# EAGLE design narvi-dac (EAGLE 7.3.0)
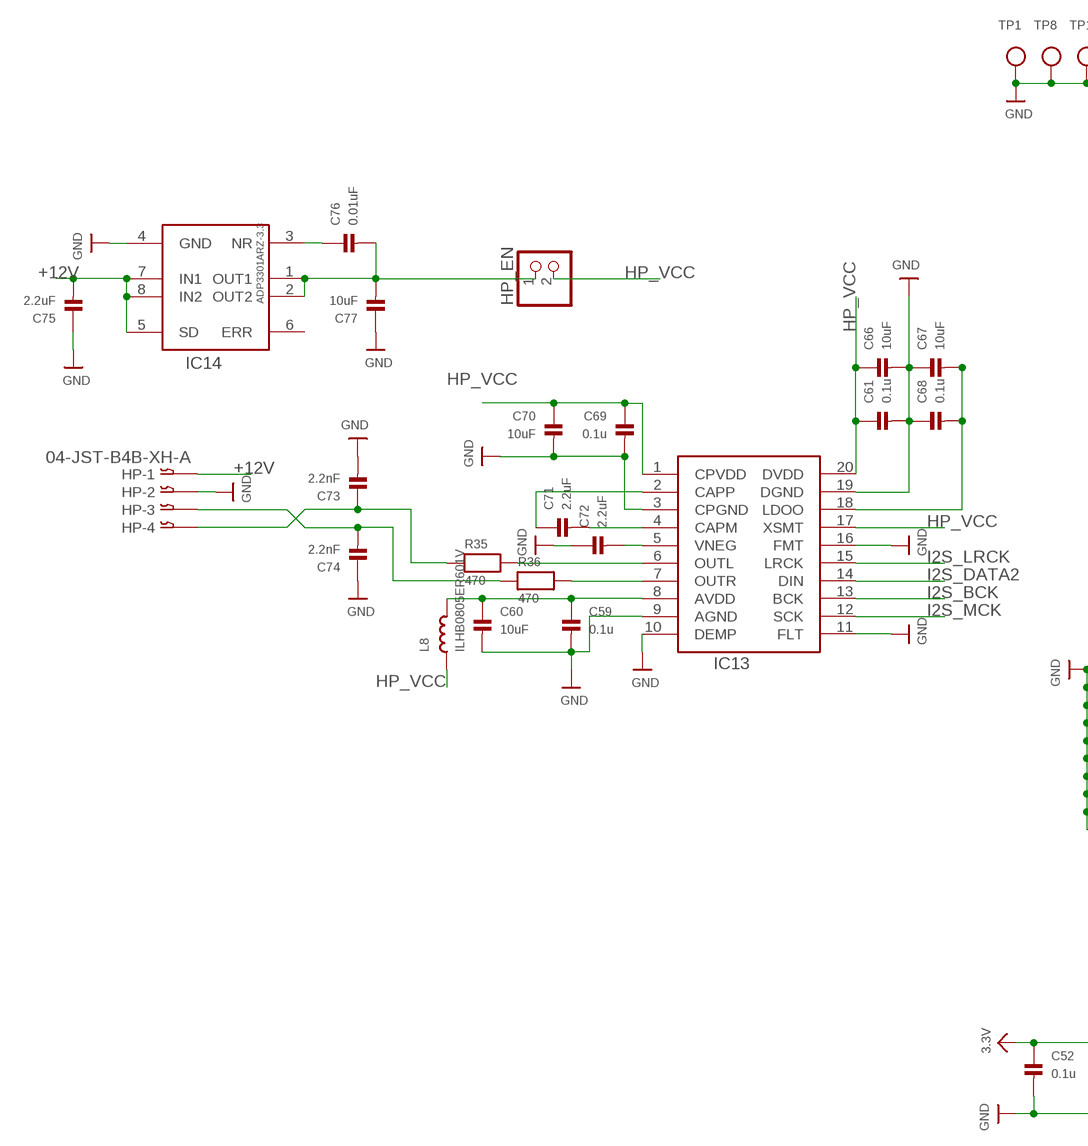
[diagram p0: schematic, sheet 1, part 1 of 2]
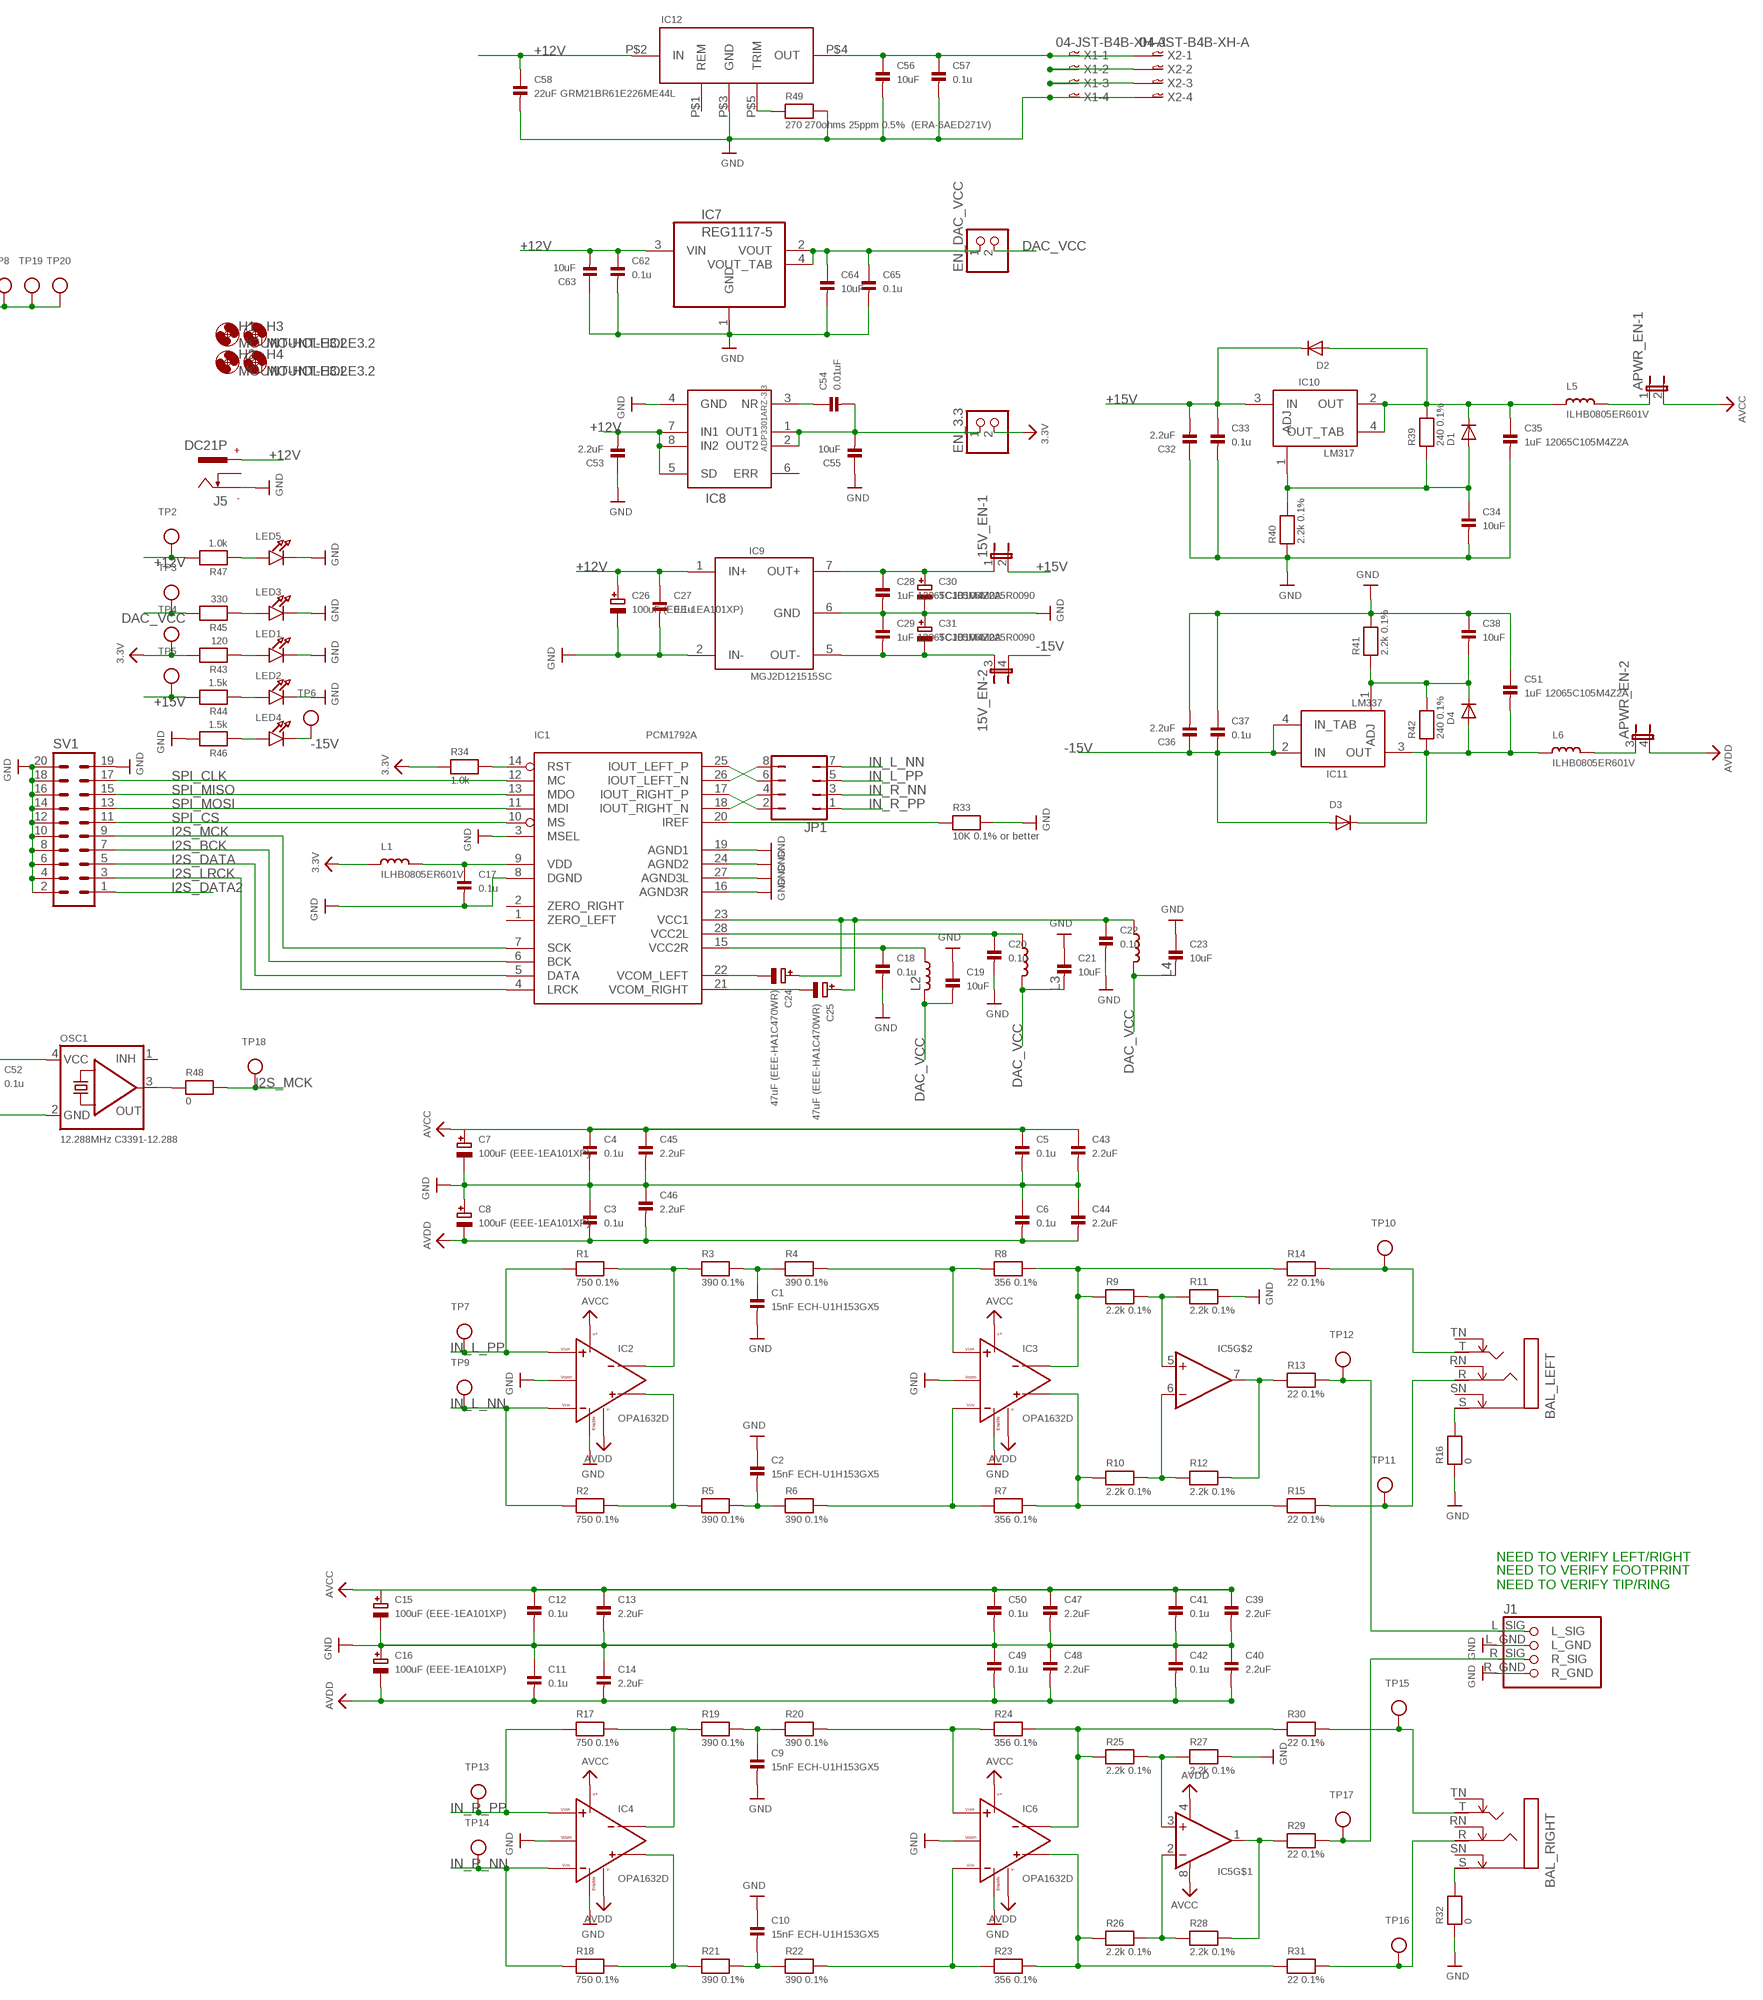
[diagram p1: schematic, sheet 1, part 2 of 2]

## Parts
15V_EN  JP2QE  [JP2Q]
APWR_EN  JP2QE  [JP2Q]
BAL_LEFT  STEREOSW  [NMJ6HCD2]
BAL_RIGHT  STEREOSW  [NMJ6HCD2]
C1  15nF ECH-U1H153GX5  CAP-1210  [1210]
C2  15nF ECH-U1H153GX5  CAP-1210  [1210]
C3  0.1u  CAP_CERAMIC0603  [0603]
C4  0.1u  CAP_CERAMIC0603  [0603]
C5  0.1u  CAP_CERAMIC0603  [0603]
C6  0.1u  CAP_CERAMIC0603  [0603]
C7  100uF (EEE-1EA101XP)  CAP_ELECTROLYTICPANASONIC_D  [PANASONIC_D]
C8  100uF (EEE-1EA101XP)  CAP_ELECTROLYTICPANASONIC_D  [PANASONIC_D]
C9  15nF ECH-U1H153GX5  CAP-1210  [1210]
C10  15nF ECH-U1H153GX5  CAP-1210  [1210]
C11  0.1u  CAP_CERAMIC0603  [0603]
C12  0.1u  CAP_CERAMIC0603  [0603]
C13  2.2uF  CAP_CERAMIC_0805  [_0805]
C14  2.2uF  CAP_CERAMIC_0805  [_0805]
C15  100uF (EEE-1EA101XP)  CAP_ELECTROLYTICPANASONIC_D  [PANASONIC_D]
C16  100uF (EEE-1EA101XP)  CAP_ELECTROLYTICPANASONIC_D  [PANASONIC_D]
C17  0.1u  CAP_CERAMIC0603  [0603]
C18  0.1u  CAP_CERAMIC0603  [0603]
C19  10uF  CAP_CERAMIC0805  [0805]
C20  0.1u  CAP_CERAMIC0603  [0603]
C21  10uF  CAP_CERAMIC0805  [0805]
C22  0.1u  CAP_CERAMIC0603  [0603]
C23  10uF  CAP_CERAMIC0805  [0805]
C24  47uF (EEE-HA1C470WR)  CAP_ELECTROLYTICPANASONIC_C  [PANASONIC_C]
C25  47uF (EEE-HA1C470WR)  CAP_ELECTROLYTICPANASONIC_C  [PANASONIC_C]
C26  100uF (EEE-1EA101XP)  CAP_ELECTROLYTICPANASONIC_D  [PANASONIC_D]
C27  0.1u  CAP_CERAMIC0603  [0603]
C28  1uF 12065C105M4Z2A  CAP_CERAMIC1206  [1206]
C29  1uF 12065C105M4Z2A  CAP_CERAMIC1206  [1206]
C30  TCJB106M025R0090  CAP-POL-1210  [1210POL]
C31  TCJB106M025R0090  CAP-POL-1210  [1210POL]
C32  2.2uF  CAP_CERAMIC_0805  [_0805]
C33  0.1u  CAP_CERAMIC0603  [0603]
C34  10uF  CAP_CERAMIC0805  [0805]
C35  1uF 12065C105M4Z2A  CAP_CERAMIC1206  [1206]
C36  2.2uF  CAP_CERAMIC_0805  [_0805]
C37  0.1u  CAP_CERAMIC0603  [0603]
C38  10uF  CAP_CERAMIC0805  [0805]
C39  2.2uF  CAP_CERAMIC_0805  [_0805]
C40  2.2uF  CAP_CERAMIC_0805  [_0805]
C41  0.1u  CAP_CERAMIC0603  [0603]
C42  0.1u  CAP_CERAMIC0603  [0603]
C43  2.2uF  CAP_CERAMIC_0805  [_0805]
C44  2.2uF  CAP_CERAMIC_0805  [_0805]
C45  2.2uF  CAP_CERAMIC_0805  [_0805]
C46  2.2uF  CAP_CERAMIC_0805  [_0805]
C47  2.2uF  CAP_CERAMIC_0805  [_0805]
C48  2.2uF  CAP_CERAMIC_0805  [_0805]
C49  0.1u  CAP_CERAMIC0603  [0603]
C50  0.1u  CAP_CERAMIC0603  [0603]
C51  1uF 12065C105M4Z2A  CAP_CERAMIC1206  [1206]
C52  0.1u  CAP_CERAMIC0603  [0603]
C53  2.2uF  CAP_CERAMIC_0805  [_0805]
C54  0.01uF  CAP_CERAMIC0603  [0603]
C55  10uF  CAP_CERAMIC0805  [0805]
C56  10uF  CAP_CERAMIC0805  [0805]
C57  0.1u  CAP_CERAMIC0603  [0603]
C58  22uF GRM21BR61E226ME44L  CAP_CERAMIC_0805  [_0805]
C59  0.1u  CAP_CERAMIC0603  [0603]
C60  10uF  CAP_CERAMIC0805  [0805]
C61  0.1u  CAP_CERAMIC0603  [0603]
C62  0.1u  CAP_CERAMIC0603  [0603]
C63  10uF  CAP_CERAMIC0805  [0805]
C64  10uF  CAP_CERAMIC0805  [0805]
C65  0.1u  CAP_CERAMIC0603  [0603]
C66  10uF  CAP_CERAMIC0805  [0805]
C67  10uF  CAP_CERAMIC0805  [0805]
C68  0.1u  CAP_CERAMIC0603  [0603]
C69  0.1u  CAP_CERAMIC0603  [0603]
C70  10uF  CAP_CERAMIC0805  [0805]
C71  2.2uF  CAP_CERAMIC_0805  [_0805]
C72  2.2uF  CAP_CERAMIC_0805  [_0805]
C73  2.2nF  CAP_CERAMIC_0805  [_0805]
C74  2.2nF  CAP_CERAMIC_0805  [_0805]
C75  2.2uF  CAP_CERAMIC_0805  [_0805]
C76  0.01uF  CAP_CERAMIC0603  [0603]
C77  10uF  CAP_CERAMIC0805  [0805]
D1  DIODESOD-123  [SOD-123]
D2  DIODESOD-123  [SOD-123]
D3  DIODESOD-123  [SOD-123]
D4  DIODESOD-123  [SOD-123]
EN_3.3  HEADER-1X2  [1X02_OVAL]
EN_DAC_VCC  HEADER-1X2  [1X02_OVAL]
H1  MOUNT-HOLE3.2  [3,2]
H2  MOUNT-HOLE3.2  [3,2]
H3  MOUNT-HOLE3.2  [3,2]
H4  MOUNT-HOLE3.2  [3,2]
HP  04-JST-B4B-XH-A  [B4B-XH]
HP_EN  HEADER-1X2  [1X02_OVAL]
IC1  PCM1792A  [SSOP28]
IC2  OPA1632D  [SO08]
IC3  OPA1632D  [SO08]
IC4  OPA1632D  [SO08]
IC5  LM4562  [SOIC8_150MIL]
IC6  OPA1632D  [SO08]
IC7  REG1117-5  REG1117  [SOT223]
IC8  ADP3301ARZ-3.3  ADP3301  [SO08]
IC9  MGJ2D121515SC  MURATA-MGJ2  [MURATA-MGJ2]
IC10  LM317  [SOT223]
IC11  LM337  [SOT223]
IC12  MURATA_OKR-T/10-W12-C  [MURATA_OKR-T/10-W12-C]
IC13  PCM5102  [TSSOP20]
IC14  ADP3301ARZ-3.3  ADP3301  [SO08]
J1  CUI-RCJ-2123  [CUI-RCJ-2123]
J5  DC21P  [CUI-PJ-102AH]
JP1  JP4Q  [JP4Q]
L1  ILHB0805ER601V  INDUCTOR_0805  [_0805]
L2  ILHB0805ER601V  INDUCTOR_0805  [_0805]
L3  ILHB0805ER601V  INDUCTOR_0805  [_0805]
L4  ILHB0805ER601V  INDUCTOR_0805  [_0805]
L5  ILHB0805ER601V  INDUCTOR_0805  [_0805]
L6  ILHB0805ER601V  INDUCTOR_0805  [_0805]
L8  ILHB0805ER601V  INDUCTOR_0805  [_0805]
LED1  LED0805  [CHIPLED_0805]
LED2  LED0805  [CHIPLED_0805]
LED3  LED0805  [CHIPLED_0805]
LED4  LED0805  [CHIPLED_0805]
LED5  LED0805  [CHIPLED_0805]
OSC1  12.288MHz C3391-12.288  OSCILLATOR  [OSC_7X5MM]
R1  750 0.1%  RESISTOR_0805  [_0805]
R2  750 0.1%  RESISTOR_0805  [_0805]
R3  390 0.1%  RESISTOR_0805  [_0805]
R4  390 0.1%  RESISTOR_0805  [_0805]
R5  390 0.1%  RESISTOR_0805  [_0805]
R6  390 0.1%  RESISTOR_0805  [_0805]
R7  356 0.1%  RESISTOR_0805  [_0805]
R8  356 0.1%  RESISTOR_0805  [_0805]
R9  2.2k 0.1%  RESISTOR_0805  [_0805]
R10  2.2k 0.1%  RESISTOR_0805  [_0805]
R11  2.2k 0.1%  RESISTOR_0805  [_0805]
R12  2.2k 0.1%  RESISTOR_0805  [_0805]
R13  22 0.1%  RESISTOR_0805  [_0805]
R14  22 0.1%  RESISTOR_0805  [_0805]
R15  22 0.1%  RESISTOR_0805  [_0805]
R16  0  RESISTOR_0805  [_0805]
R17  750 0.1%  RESISTOR_0805  [_0805]
R18  750 0.1%  RESISTOR_0805  [_0805]
R19  390 0.1%  RESISTOR_0805  [_0805]
R20  390 0.1%  RESISTOR_0805  [_0805]
R21  390 0.1%  RESISTOR_0805  [_0805]
R22  390 0.1%  RESISTOR_0805  [_0805]
R23  356 0.1%  RESISTOR_0805  [_0805]
R24  356 0.1%  RESISTOR_0805  [_0805]
R25  2.2k 0.1%  RESISTOR_0805  [_0805]
R26  2.2k 0.1%  RESISTOR_0805  [_0805]
R27  2.2k 0.1%  RESISTOR_0805  [_0805]
R28  2.2k 0.1%  RESISTOR_0805  [_0805]
R29  22 0.1%  RESISTOR_0805  [_0805]
R30  22 0.1%  RESISTOR_0805  [_0805]
R31  22 0.1%  RESISTOR_0805  [_0805]
R32  0  RESISTOR_0805  [_0805]
R33  10K 0.1% or better  RESISTOR_0805  [_0805]
R34  1.0k  RESISTOR_0805  [_0805]
R35  470  RESISTOR_0805  [_0805]
R36  470  RESISTOR_0805  [_0805]
R39  240 0.1%  RESISTOR_0805  [_0805]
R40  2.2k 0.1%  RESISTOR_0805  [_0805]
R41  2.2k 0.1%  RESISTOR_0805  [_0805]
R42  240 0.1%  RESISTOR_0805  [_0805]
R43  120  RESISTOR_0805  [_0805]
R44  1.5k  RESISTOR_0805  [_0805]
R45  330  RESISTOR_0805  [_0805]
R46  1.5k  RESISTOR_0805  [_0805]
R47  1.0k  RESISTOR_0805  [_0805]
R48  0  RESISTOR_0805  [_0805]
R49  270 270ohms 25ppm 0.5% (ERA-6AED271V)  RESISTOR_0805  [_0805]
SV1  ML20  [ML20]
TP1  TESTPOINT0.1"  [1X01_ROUND]
TP2  TESTPOINT0.1"  [1X01_ROUND]
TP3  TESTPOINT0.1"  [1X01_ROUND]
TP4  TESTPOINT0.1"  [1X01_ROUND]
TP5  TESTPOINT0.1"  [1X01_ROUND]
TP6  TESTPOINT0.1"  [1X01_ROUND]
TP7  TESTPOINT0.1"  [1X01_ROUND]
TP8  TESTPOINT0.1"  [1X01_ROUND]
TP9  TESTPOINT0.1"  [1X01_ROUND]
TP10  TESTPOINT0.1"  [1X01_ROUND]
TP11  TESTPOINT0.1"  [1X01_ROUND]
TP12  TESTPOINT0.1"  [1X01_ROUND]
TP13  TESTPOINT0.1"  [1X01_ROUND]
TP14  TESTPOINT0.1"  [1X01_ROUND]
TP15  TESTPOINT0.1"  [1X01_ROUND]
TP16  TESTPOINT0.1"  [1X01_ROUND]
TP17  TESTPOINT0.1"  [1X01_ROUND]
TP18  TESTPOINT0.1"  [1X01_ROUND]
TP19  TESTPOINT0.1"  [1X01_ROUND]
TP20  TESTPOINT0.1"  [1X01_ROUND]
X1  04-JST-B4B-XH-A  [B4B-XH]
X2  04-JST-B4B-XH-A  [B4B-XH]

## Nets
3.3V: C52.1 EN_3.3.2 L1.1 OSC1.4(VCC) R34.1 R43.2 TP4.1
+12V: C26.+ C27.1 C53.2 C58.1 C62.1 C63.2 C75.2 HP.P$1 IC7.3(VIN) IC8.5(SD) IC8.7(IN1) IC8.8(IN2) IC9.1(IN+) IC12.P$2(IN) IC14.5(SD) IC14.7(IN1) IC14.8(IN2) J5.+ R47.2 TP2.1
+15V: 15V_EN.2 C32.2 C33.1 D2.C IC10.3(IN) R44.2 TP5.1
-15V: 15V_EN.4 C36.1 C37.2 D3.A IC11.2(IN) IC11.4(IN_TAB) LED4.C TP6.1
AVCC: APWR_EN.2 C4.1 C5.1 C7.+ C12.1 C13.1 C15.+ C39.1 C41.1 C43.1 C45.1 C47.1 C50.1 IC2.3(V+) IC3.3(V+) IC4.3(V+) IC5.8(V+) IC6.3(V+)
AVDD: APWR_EN.4 C3.2 C6.2 C8.- C11.2 C14.2 C16.- C40.2 C42.2 C44.2 C46.2 C48.2 C49.2 IC2.6(V-) IC3.6(V-) IC4.6(V-) IC5.4(V-) IC6.6(V-)
CAN_H: X1.P$3 X2.P$3
CAN_L: X1.P$2 X2.P$2
DAC_VCC: C19.2 C21.2 C23.2 EN_DAC_VCC.2 L2.2 L3.2 L4.2 R45.2 TP3.1
GND: C1.2 C2.1 C3.1 C4.2 C5.2 C6.1 C7.- C8.+ C9.2 C10.1 C11.1 C12.2 C13.2 C14.1 C15.- C16.+ C17.2 C18.2 C19.1 C20.2 C21.1 C22.2 C23.1 C26.- C27.2 C28.2 C29.1 C30.2-(-) C31.1+(+) C32.1 C33.2 C34.2 C35.2 C36.2 C37.1 C38.1 C39.2 C40.1 C41.2 C42.1 C43.2 C44.1 C45.2 C46.1 C47.2 C48.1 C49.1 C50.2 C51.1 C52.2 C53.1 C55.1 C56.2 C57.2 C58.2 C59.2 C60.2 C61.2 C62.2 C63.1 C64.2 C65.2 C66.2 C67.1 C68.1 C69.2 C70.2 C72.1 C73.2 C74.1 C75.1 C77.1 HP.P$2 IC1.3(MSEL) IC1.8(DGND) IC1.16(AGND3R) IC1.19(AGND1) IC1.24(AGND2) IC1.27(AGND3L) IC2.2(VCOM) IC2.7(ENABLE) IC3.2(VCOM) IC3.7(ENABLE) IC4.2(VCOM) IC4.7(ENABLE) IC6.2(VCOM) IC6.7(ENABLE) IC7.1(GND) IC8.4(GND) IC9.2(IN-) IC9.6(GND) IC12.P$3(GND) IC13.3(CPGND) IC13.9(AGND) IC13.10(DEMP) IC13.11(FLT) IC13.16(FMT) IC13.19(DGND) IC14.4(GND) J1.L_GND J1.R_GND J5.- LED1.C LED2.C LED3.C LED5.C OSC1.2(GND) R11.2 R16.1 R27.2 R32.1 R33.2 R40.1 R41.2 R46.2 R49.2 SV1.2 SV1.4 SV1.6 SV1.8 SV1.10 SV1.12 SV1.14 SV1.16 SV1.18 SV1.19 SV1.20 TP1.1 TP8.1 TP19.1 TP20.1 X1.P$4 X2.P$4
HP_L_OUT: C73.1 HP.P$4 R35.1
HP_R_OUT: C74.2 HP.P$3 R36.1
HP_VCC: C61.1 C66.1 C69.1 C70.1 HP_EN.2 IC13.1(CPVDD) IC13.17(XSMT) IC13.20(DVDD) L8.1
I2S_BCK: IC1.6(BCK) IC13.13(BCK) SV1.7
I2S_DATA: IC1.5(DATA) SV1.5
I2S_DATA2: IC13.14(DIN) SV1.1
I2S_LRCK: IC1.4(LRCK) IC13.15(LRCK) SV1.3
I2S_MCK: IC1.7(SCK) IC13.12(SCK) R48.2 SV1.9 TP18.1
IN_L_NN: IC2.1(VIN-) JP1.7 R2.1 TP9.1
IN_L_PP: IC2.8(VIN+) JP1.5 R1.1 TP7.1
IN_R_NN: IC4.1(VIN-) JP1.3 R18.1 TP14.1
IN_R_PP: IC4.8(VIN+) JP1.1 R17.1 TP13.1
N$1: IC2.5(VOUT-) R1.2 R3.1
N$2: IC2.4(VOUT+) R2.2 R5.1
N$3: C1.1 R3.2 R4.1
N$4: C2.2 R5.2 R6.1
N$5: IC3.8(VIN+) R4.2 R8.1
N$6: IC3.1(VIN-) R6.2 R7.1
N$7: IC1.17(IOUT_RIGHT_P) JP1.2
N$8: IC1.18(IOUT_RIGHT_N) JP1.4
N$9: IC5.5(+IN) R9.2 R11.1
N$10: IC5.6(-IN) R10.2 R12.1
N$11: IC5.7(OUT) R12.2 R13.1
N$12: J1.L_SIG R13.2 TP12.1
N$13: BAL_LEFT.S R16.2
N$14: BAL_LEFT.T R14.2 TP10.1
N$15: BAL_LEFT.R R15.2 TP11.1
N$16: IC4.5(VOUT-) R17.2 R19.1
N$17: IC4.4(VOUT+) R18.2 R21.1
N$18: C9.1 R19.2 R20.1
N$19: C10.2 R21.2 R22.1
N$20: IC6.8(VIN+) R20.2 R24.1
N$21: IC6.1(VIN-) R22.2 R23.1
N$22: IC1.26(IOUT_LEFT_N) JP1.8
N$23: IC1.25(IOUT_LEFT_P) JP1.6
N$24: IC5.3(+IN) R25.2 R27.1
N$25: IC5.2(-IN) R26.2 R28.1
N$27: J1.R_SIG R29.2 TP17.1
N$28: BAL_RIGHT.S R32.2
N$29: BAL_RIGHT.T R30.2 TP15.1
N$30: BAL_RIGHT.R R31.2 TP16.1
N$31: C56.1 C57.1 IC12.P$4(OUT) X1.P$1 X2.P$1
N$32: OSC1.3(OUT) R48.1
N$33: IC12.P$5(TRIM) R49.1
N$34: IC5.1(OUT) R28.2 R29.1
N$35: IC1.20(IREF) R33.1
N$36: C18.1 IC1.15(VCC2R) L2.1
N$37: C17.1 IC1.9(VDD) L1.2
N$38: C20.1 IC1.28(VCC2L) L3.1
N$39: C22.1 C24.+ C25.+ IC1.23(VCC1) L4.1
N$40: C24.- IC1.22(VCOM_LEFT)
N$41: C25.- IC1.21(VCOM_RIGHT)
N$42: IC1.14(RST) R34.2
N$43: C59.1 C60.1 IC13.8(AVDD) L8.2
N$44: C67.2 C68.2 IC13.18(LDOO)
N$45: C71.1 IC13.2(CAPP)
N$46: C54.2 C55.2 EN_3.3.1 IC8.1(OUT1) IC8.2(OUT2)
N$47: C54.1 IC8.3(NR)
N$49: 15V_EN.3 C29.2 C31.2-(-) IC9.5(OUT-)
N$50: 15V_EN.1 C28.1 C30.1+(+) IC9.7(OUT+)
N$51: C64.1 C65.1 EN_DAC_VCC.1 IC7.2(VOUT) IC7.4(VOUT_TAB)
N$52: APWR_EN.1 L5.2
N$53: C35.1 D1.C D2.A IC10.2(OUT) IC10.4(OUT_TAB) L5.1 R39.2
N$54: C34.1 D1.A IC10.1(ADJ) R39.1 R40.2
N$55: APWR_EN.3 L6.2
N$56: LED1.A R43.1
N$57: C51.2 D3.C D4.A IC11.3(OUT) L6.1 R42.1
N$58: C38.2 D4.C IC11.1(ADJ) R41.1 R42.2
N$59: LED3.A R45.1
N$60: LED2.A R44.1
N$61: LED4.A R46.1
N$62: LED5.A R47.1
N$64: C71.2 IC13.4(CAPM)
N$65: C72.2 IC13.5(VNEG)
N$66: C76.1 IC14.3(NR)
N$67: IC13.6(OUTL) R35.2
N$68: IC13.7(OUTR) R36.2
N$71: C76.2 C77.2 HP_EN.1 IC14.1(OUT1) IC14.2(OUT2)
OUT_L_NN: IC3.4(VOUT+) R7.2 R10.1 R15.1
OUT_L_PP: IC3.5(VOUT-) R8.2 R9.1 R14.1
OUT_R_NN: IC6.4(VOUT+) R23.2 R26.1 R31.1
OUT_R_PP: IC6.5(VOUT-) R24.2 R25.1 R30.1
SPI_CLK: IC1.12(MC) SV1.17
SPI_CS: IC1.10(MS) SV1.11
SPI_MISO: IC1.13(MDO) SV1.15
SPI_MOSI: IC1.11(MDI) SV1.13
Unconnected: BAL_LEFT.RN BAL_LEFT.SN BAL_LEFT.TN BAL_RIGHT.RN BAL_RIGHT.SN BAL_RIGHT.TN IC1.1(ZERO_LEFT) IC1.2(ZERO_RIGHT) IC8.6(ERR) IC12.P$1(REM) IC14.6(ERR) J5.C OSC1.1(INH)

## Notes on the sheet
- NEED TO VERIFY LEFT/RIGHT
- NEED TO VERIFY FOOTPRINT
  NEED TO VERIFY TIP/RING

## Library data of the parts
15V_EN APWR_EN = jumper:JP2QE: JUMPER
BAL_LEFT BAL_RIGHT = pl-jacks:STEREOSW
C1 C2 C9 C10 = keves:CAP-1210
C3-C6 C11-C14 C17-C23 C27-C29 C32-C77 = microbuilder:CAP_CERAMIC: Ceramic Capacitors 0402 - 0402 Surface Mount Capacitors 16pF 50V 5% [Digikey: 445-4899-2-ND] 18pF 50V 5% [Digikey: 490-1281-2-ND] 22pF 50V 5% [Digikey: 490-1283-2-ND] 68pF 50V 5% [Digikey: 490-1289-2-ND] 0.1uF 10V 10% [Digikey: 490-1318-2-ND] 1.0uF 6.3V 10% [Digikey: 490-1320-2-ND] 0603 - 0603 Surface Mount Capacitors 16 pF 50V 5% [Digikey: 445-5051-2-ND] 22 pF 50V [Digikey: PCC220ACVTR-ND] 33 pF 50V 5% [Digikey: 490-1415-1-ND] 56pF 50V 5% [Digikey: 490-1421-1-ND] 220pF 50V 5% [Digikey: 445-1285-1-ND] 680 pF 50V 2200 pF 50V 5% C0G [Digikey: 445-1297-1-ND] 5600 pF 100V 5% X7R [Digikey: 478-3711-1-ND] 0.1 µF 25V 10% [Digikey: PCC2277TR-ND] 0.22 µF 16V 10% X7R [Digikey: 445-1318-1-ND] 1.0 µF 25V 10% [Digikey: 445-5146-2-ND] 0603 - RF Specific 3pF 250V +/-0.1pF RF [Digikey: 712-1347-1-ND] 18 pF 250V 5% [Digikey: 478-3505-1-ND or 712-1322-1-ND] 56 pF 250V 5% C0G RF [Digikey: 490-4867-1-ND] 68 pF 250V RF [Digikey: 490-4868-1-ND] 0805 - 0805 Surface Mount Capacitors 220 pF 250V 2% RF Ceramic Capacitor [Digikey: 712-1398-1-ND] 1000 pF 50V 2% NP0 Ceramic Capacitor [Digikey: 478-3760-1-ND] 0.1 µF 25V 10% Ceramic Capacitor [Digikey: PCC1828TR-ND] 1.0 µF 16V 10% Ceramic Capacitor[Digikey: 490-1691-2-ND] 10.0 µF 10V 10% Ceramic Capacitor[Digikey: 709-1228-1-ND] 10.0 uF 16V 10% Ceramic Capacitor [Digikey: 478-5165-2-ND] 47 uF 6.3V 20% Ceramic Capacitor [Digikey: 587-1779-1-ND or 399-5506-1-ND] 1206 - 1206 Surface Mount Capacitors 47uF 10V 20% Ceramic Capacitor [Digikey: 490-5528-1-ND or 399-5508-1-ND or 445-6010-1-ND] 100uF 6.3V -20%, +80% Y5V Ceramic Capacitor (Digikey: 490-4512-1-ND, Mouser: 81-GRM31CF50J107ZE1L)
C7 C8 C15 C16 C24-C26 = microbuilder:CAP_ELECTROLYTIC: Electrolytic Capacitors SMT PANASONIC_C - Size C Panasonic Electrolytic Aluminum Capacitor 47µF 16V 20% Electrolytic Capacitor [Digikey: PCE3890TR-ND] PANASONIC_D - Size D Panasonic Electrolytic Aluminum Capacitor 100µF 25V 20% Electrolytic Capacitor [Digikey: PCE3898TR-ND] PTH 3.5 mm grid, 8 mm diameter ... 3.5 mm grid, 10 mm diameter ...
C30 C31 = keves:CAP-POL-1210
D1-D4 = microbuilder:DIODE: Diode SMA Model Volts Amps Type Vf Vr Digikey # Notes SSA34-E3 40V 3A Schottky 480mV @ 3A 200uA @ 40V SSA34-E3/61TGITR-ND CDBA120-G 20V 1A Schottky 500mV @ 1A 500uA @ 20V 641-1014-6-ND REEL MBRA210 10V 2A Schottky 350mV @ 2A 700uA @ 10V MBRA210LT3 SOD-123 Model Volts Amps Type Vf Vr Order # Notes BAT54T1G 30V 200mA Schottky 800mV @ 200mA 2uA @ 25V BAT54T1GOSTR-ND B0530W 30V 500mA Schottky 430mV @ 500mA 130uA @ 30V B0530W-FDICT-ND REEL MBR120 1A 20V Schottky 340mV @ 1A MBR120VLSFT1GOSCT-ND SOD-323 Model Volts Amps Type Vf Vr Order # Notes PMEG2005EJ 20V 500mA Schottky 355mV @ 500mA 568-4110-1-ND ZLLS410 10V 570mA Schottky 380mV @ 570mA ZLLS410CT-ND 1N4148WS 75V 150mA Silicon/Simple 1V 1N4148WSFSCT-ND REEL SOD-523 Model Volts Amps Type Vf Vr Order # Notes BAT54XV2 30V 200mA Schottky 0.8V @ 100mA BAT54XV2CT-ND TB751S 30V 30mA Schottky RB751S-40TE61CT-ND SOT23-R/W (R = Solder Paste/Reflow Ovens, W = Hand-Soldering) Model Volts Amps Type Vf Vr Order # Notes BAT54FILM 40V 300mA Schottky 497-7162-1-ND
EN_3.3 EN_DAC_VCC HP_EN = microbuilder:HEADER-1X2: PIN HEADER
H1-H4 = holes:MOUNT-HOLE: MOUNTING HOLE with drill center marker; POPULATE: 0
HP X1 X2 = bt_con-jst-xh:04-JST: JST CONNECTOR; MPN: B4B-XH-A(LF)(SN)
IC1 = keves:PCM1792A
IC2-IC4 IC6 = keves:OPA1632D
IC5 = keves:LM4562: LM358 Dual Operational Amplifier Digikey: LM358AMXFSCT-ND
IC7 = burr-brown:REG1117: 800mA and 1A Low Dropout (LDO) Positive Regulator 1.8V, 2.5V, 2.85V, 3.3V, 5V, and Adj; MPN: REG1117; OC_FARNELL: 1097566; OC_NEWARK: 14P6981
IC8 IC14 = keves:ADP3301
IC9 = keves:MURATA-MGJ2
IC10 = keves:LM317
IC11 = keves:LM337
IC12 = keves:MURATA_OKR-T/10-W12-C
IC13 = PCM5102:PCM5102
J1 = keves:CUI-RCJ-2123
J5 = keves:DC21P: DC 2.1 mm Power Socket Positive Centre
JP1 = jumper:JP4Q: JUMPER
L1-L6 L8 = microbuilder:INDUCTOR: Inductors 0603: 10nH Ceramic Inductor - microwire antenna/RF (Digikey: 712-1434-2-ND) 0805: 560nH Ceramic Inductor - RF (Digikey: 553-1047-1-ND) 270nH Ceramic Inductor - Q = 40@250MHz, +-5%, 1 Ohm DC Resistance (Digikey: 535-10506-2-ND) 1007 (2518 Metric) SMT: 10µH 10% 250mOhm 820mA 1007 Inductor (Digikey: 587-2189-1-ND) 22µH 10% 500mOhm 580mA 1007 Inductor (Digikey: 587-2190-1-ND) 47µH 10% 950mOhm 420mA 1007 Inductor (Digikey: 587-2191-1-ND) 47µH 5% 100mOhm 1A 1008 Inductor (Digikey: 732-1816-1-ND) 5.0x5.0mm (Taiyo Yuden NR5040 Series) 6.8µH 20% 2.3A 64mOhm Inductor (Digikey: 587-2374-2-ND) 5.0x5.0mm (TDK VLC5045 Series) 4.7µH 20% 3.3A 34mOhm Inductor (Digikey: 445-6526-1-ND) 6.8µH 20% 2.7A 46mOhm Inductor (Digikey: 445-6527-1-ND) 6.0x6.0mm (TDK VLC6045 Series) 4.7µH 20% 3.8A 27mOhm Inductor (Digikey: 445-6538-2-ND) 6.8µH 20% 3A 41mOhm Inductor (Digikey: 445-6540-1-ND) 6.2µH 30% 2.2A 45mOhm Inductor (Digikey: SRR5028-6R2YCT-ND) - Not TDK VLC6045 but footprint should match 6.0x6.0mm (TDK SLF6045 Series) 6.8uH 30% 2A 33mOhm Inductor (Digikey: 445-4572-1-ND, Mouser: 810-SLF645T6R8N2R0PF)
LED1-LED5 = microbuilder:LED: LED 0603 - 0603 Surface Mount Package 2mA: Green LED - Low Power (3.9mcd, 2ma, 1.7Vf) - Digikey: 475-2709-2-ND Orange LED - Low Power (9.8mcd, 2ma, 1.8Vf) - Digikey: 475-1194-2-ND Red LED - Low Power (5mcd, 2ma, 1.8Vf) - Digikey: 475-1195-2-ND Yellow LED - Low Power (7mcd, 2ma, 1.8Vf) - Digikey: 475-1196-2-ND 5mA: Blue LED - Low Power (17mcd, 5ma, 2.9Vf) - Digikey: LNJ937W8CRACT-ND 0805 - 0805 Surface Mount Package 2mA: Red LED (8.8mcd, 2mA, 1.8Vf, Clear) - Low Power [Digikey: 475-2510-1-ND] Green LED (5mcd, 2mA, 1.8Vf, Clear) - Low Power [Digikey: 475-2730-1-ND] Yellow LED (11.3mcd, 2mA, 1.8Vf, Clear) - Low Power [Digikey: 475-2555-1-ND] 20mA: Red LED (104mcd, 20mA, Diffused) - LS R976 [Digikey: 475-1278-6-ND] Red LED (12mcd, 20mA, 2.0Vf, Clear) - APT2012EC [Digikey: 754-1128-1-ND] Green LED (15mcd, 20mA, 2.2Vf, Clear) - APT2012GC [Digikey: 754-1131-1-ND] Orange LED (160mcd, 20mA, 2.1Vf, Clear) - APT2012SECK [Digikey: 754-1130-1-ND] 1206 - 1206 Surface Mount Package Green LED (26mcd, 20mA, Diffused) - LG N971 [Digikey: 475-1407-6-ND] Red LED (15mcd, 20mA, Diffused) - LH N974 [Digikey: 475-1416-6-ND]
OSC1 = microbuilder:OSCILLATOR: Oscillators 3.2x2.5mm SMT 4.0MHz +/- 50ppm, 3.3V, 9mA, -40/+85°C - Digikey: 535-9752-1-ND 50MHz +/- 50ppm, 3.3V, 8mA, -10/+70°C - Digikey: 478-4792-1-ND 5x7mm SMT 4.0MHz +/-20ppm 3.3V, 20mA, -20/+70°C - Digikey: 535-9329-2-ND 50MHz +/- 25ppm 3.3V, 35mA, -40/+85°C - Digikey: 631-1197-1-ND
R1-R36 R39-R49 = microbuilder:RESISTOR: Resistors 0402 - 0402 Surface Mount Package 22 Ohm 1% 1/16W [Digikey: 311-22.0LRTR-ND] 33 Ohm 5% 1/16W 1.0K 5% 1/16W 1.5K 5% 1/16W 2.0K 1% 1/16W 10.0K 1% 1/16W [Digikey: 311-10.0KLRTR-ND] 10.0K 5% 1/16W [Digikey: RMCF0402JT10K0TR-ND] 12.1K 1% 1/16W [Digikey: 311-22.0LRTR-ND] 100.0K 5% 1/16W 0603 - 0603 Surface Mount Package 0 Ohm 1/10 Watt 1% Resistor 15 Ohm 1/10 Watt 1% Resistor 33 Ohm 1/10 Watt 1% Resistor 49.9 Ohm 1/10 Watt 1% Resistor 100 Ohm 1/10 Watt 1% Resistor 150 Ohm 1/10 Watt 1% Resistor 240 Ohm 1/10 Watt 1% Resistor 390 Ohm 1/10 Watt 1% Resistor 560 Ohm 1/10 Watt 1% Resistor 680 Ohm 1/10 Watt 1% Resistor 750 Ohm 1/10 Watt 1% Resistor 1.0K Ohm 1/10 Watt 1% Resistor 1.5K Ohm 1/10 Watt 1% Resistor 2.0K Ohm 1/10 Watt 1% Resistor 2.2K Ohm 1/10 Watt 1% Resistor 3.3K Ohm 1/10 Watt 1% Resistor 4.7K Ohm 1/10 Watt 1% Resistor 10.0K Ohm 1/10 Watt 1% Resistor 12.0K Ohm 1/10 Watt 1% Resistor 12.1K Ohm 1/10 Watt 1% Resistor 20.0K Ohm 1/10 Watt 1% Resistor 33.0K Ohm 1/10 Watt 1% Resistor 100.0K Ohm 1/10 Watt 1% Resistor 0805 - 0805 Surface Mount Package 0 Ohm 1/8 Watt 1% Resistor 33 Ohm 1/8 Watt 1% Resistor 100 Ohm 1/8 Watt 1% Resistor 150 Ohm 1/8 Watt 1% Resistor 200 Ohm 1/8 Watt 1% Resistor 240 Ohm 1/8 Watt 1% Resistor 330 Ohm 1/8 Watt 1% Resistor 390 Ohm 1/8 Watt 1% Resistor 470 Ohm 1/8 Watt 1% Resistor 1.0K Ohm 1/8 Watt 1% Resistor 1.5K Ohm 1/8 Watt 1% Resistor 2.0K Ohm 1/8 Watt 1% Resistor 4.7K Ohm 1/8 Watt 1% Resistor 5.1K Ohm 1/8 Watt 1% Resistor 5.6K Ohm 1/8 Watt 1% Resistor 10.0K Ohm 1/8 Watt 1% Resistor 22.0K Ohm 1/8 Watt 1% Resistor 33.0K Ohm 1/8 Watt 1% Resistor 100K Ohm 1/8 Watt 1% Resistor 1206 - 1206 Surface Mount Package 2012 - 2010 Surface Mount Package 0.11 Ohm 1/2 Watt 1% Resistor - Digikey: RHM.11UCT-ND
SV1 = con-harting-ml:ML20: HARTING; OC_FARNELL: unknown; OC_NEWARK: unknown
TP1-TP20 = microbuilder:TESTPOINT: Test Point Various test points for characterisation and PCB testing TESTPOINT_SMT - Compact Surface Mount Test Point [Digikey: 5016KTR-ND]; BOM: EXCLUDE

## Board
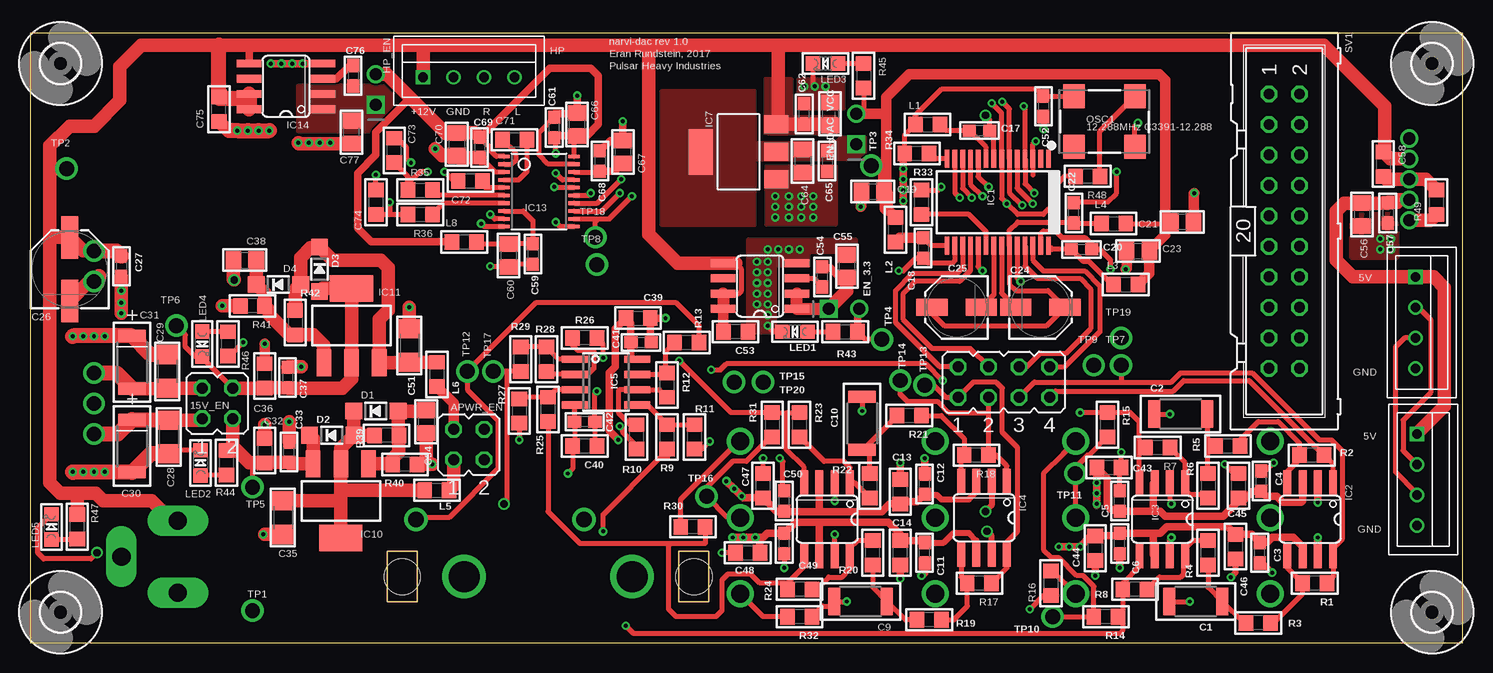
[diagram p2: board, top side]
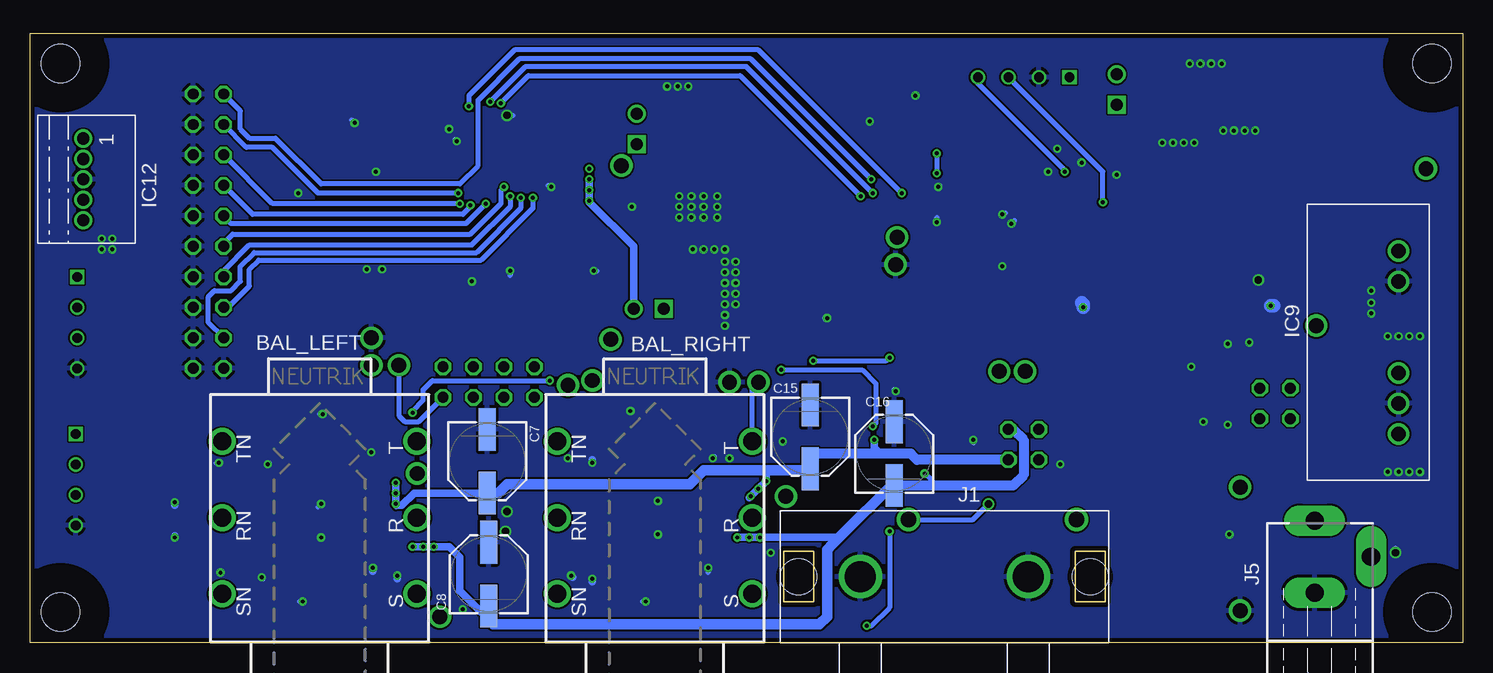
[diagram p3: board, bottom side, seen from below]

Size 119.38 x 50.8 mm. Coordinates in mm from the lower left corner, seen from the top.
Outline: 0,0 119.38,0 119.38,50.8 0,50.8 0,0
Copper layers (1*16): Top 0.0356mm / dielectric 1.5011mm / Bottom 0.0356mm
Design rules "oshpark-2layer-2017-05": minimum track width 6mil, minimum drill 13mil, track to track 6mil, track to pad 6mil, pad to pad 6mil, via to via 6mil, smd to smd 6mil, copper to edge 15mil, drill to drill 6mil, minimum pad ring 7mil, minimum via ring 7mil, stop-mask expansion 2.5mil, vias tented up to drill 0mil, thermal gap 10mil

### Footprints (pad centres in the part's own frame; a part is rotated, then mirrored left to right if it is on the bottom)
JP2Q = drill 0.914 octagon: 1 -1.27,-1.27; 2 1.27,-1.27; 3 -1.27,1.27; 4 1.27,1.27
NMJ6HCD2 = drill 1.5: R 0,8.115; RN 0,-8.115; S 6.35,8.115; SN 6.35,-8.115; T -6.35,8.115; TN -6.35,-8.115
1210 = smd 1 x 2.3: 1 -2.2,0; 2 2.2,0
0603 = smd 1.1 x 1: 1 -0.85,0; 2 0.85,0
PANASONIC_D = smd 3.556 x 1.4: + 2.654,0; - -2.654,0
_0805 = smd 1.2 x 1.3: 1 -1.016,0; 2 1.016,0
0805 = smd 1.3 x 1.5: 1 -0.95,0; 2 0.95,0
PANASONIC_C = smd 2.6 x 1.4: + 2.05,0; - -2.05,0
1206 = smd 1.6 x 1.8: 1 -1.4,0; 2 1.4,0
1210POL = smd 1 x 2.3: 1+ -2.2,0; 2- 2.2,0
SOD-123 = smd 1.4 x 1.4: A 1.85,0; C -1.85,0
1X02_OVAL = drill 1 square: 1 -1.27,0 | drill 1: 2 1.27,0
3,2 = hole 3.2: 0,0
B4B-XH = drill 0.8 square: P$1 -3.81,0 | drill 0.8: P$2 -1.27,0; P$3 1.27,0; P$4 3.81,0
SSOP28 = smd 0.4 x 1.5: 1 -4.225,-3.625; 2 -3.575,-3.625; 3 -2.925,-3.625; 4 -2.275,-3.625; 5 -1.625,-3.625; 6 -0.975,-3.625; 7 -0.325,-3.625; 8 0.325,-3.625; 9 0.975,-3.625; 10 1.625,-3.625; 11 2.275,-3.625; 12 2.925,-3.625; 13 3.575,-3.625; 14 4.225,-3.625; 15 4.225,3.625; 16 3.575,3.625; 17 2.925,3.625; 18 2.275,3.625; 19 1.625,3.625; 20 0.975,3.625; 21 0.325,3.625; 22 -0.325,3.625; 23 -0.975,3.625; 24 -1.625,3.625; 25 -2.275,3.625; 26 -2.925,3.625; 27 -3.575,3.625; 28 -4.225,3.625
SO08 = smd 0.66 x 2.032: 1 -1.905,-3.073; 2 -0.635,-3.073; 3 0.635,-3.073; 4 1.905,-3.073; 5 1.905,3.073; 6 0.635,3.073; 7 -0.635,3.073; 8 -1.905,3.073
SOIC8_150MIL = smd 0.6 x 2.2: 1 -1.905,-2.6; 2 -0.635,-2.6; 3 0.635,-2.6; 4 1.905,-2.6; 5 1.905,2.6; 6 0.635,2.6; 7 -0.635,2.6; 8 -1.905,2.6
SOT223 = smd 1.499 x 2.007: 1 -2.261,-3.15; 2 0.025,-3.15; 3 2.311,-3.15 | smd 3.81 x 2.007: 4 0,3.15
MURATA-MGJ2 = drill 1.2: 1 0,0; 2 2.54,0; 5 10.16,0; 6 12.7,0; 7 15.24,0
SOT223' = smd 1.219 x 2.235: 1 -2.311,-3.099; 2 0,-3.099; 3 2.311,-3.099 | smd 3.6 x 2.2: 4 0,3.099
MURATA_OKR-T/10-W12-C = drill 1.016 pad 1.422: P$1 -3.404,0; P$2 -1.702,0; P$3 0,0; P$4 1.702,0; P$5 3.404,0
TSSOP20 = smd 0.305 x 0.991: 1 -2.925,-2.918; 2 -2.275,-2.918; 3 -1.625,-2.918; 4 -0.975,-2.918; 5 -0.325,-2.918; 6 0.325,-2.918; 7 0.975,-2.918; 8 1.625,-2.918; 9 2.275,-2.918; 10 2.925,-2.918; 11 2.925,2.918; 12 2.275,2.918; 13 1.625,2.918; 14 0.975,2.918; 15 0.325,2.918; 16 -0.325,2.918; 17 -0.975,2.918; 18 -1.625,2.918; 19 -2.275,2.918; 20 -2.925,2.918
CUI-RCJ-2123 = drill 2.6: L_GND -7,-5.5; R_GND 7,-5.5 | drill 1.3: L_SIG -11,-10.25; R_SIG 3,-10.25 | hole 3: -12.15,-5.5; 12.15,-5.5
CUI-PJ-102AH = drill 1.524 pad 2.54 long: + 4.7,0; - 4.7,6; C 0,3
JP4Q = drill 0.914 octagon: 1 -3.81,-1.27; 2 -3.81,1.27; 3 -1.27,-1.27; 4 -1.27,1.27; 5 1.27,-1.27; 6 1.27,1.27; 7 3.81,-1.27; 8 3.81,1.27
CHIPLED_0805 = smd 1.2 x 1.2: A 0,-1.05; C 0,1.05
OSC_7X5MM = smd 1.8 x 2: 1 -2.54,-2.1; 2 2.54,-2.1; 3 2.54,2.1; 4 -2.54,2.1
ML20 = drill 0.914 octagon: 1 -11.43,-1.27; 2 -11.43,1.27; 3 -8.89,-1.27; 4 -8.89,1.27; 5 -6.35,-1.27; 6 -6.35,1.27; 7 -3.81,-1.27; 8 -3.81,1.27; 9 -1.27,-1.27; 10 -1.27,1.27; 11 1.27,-1.27; 12 1.27,1.27; 13 3.81,-1.27; 14 3.81,1.27; 15 6.35,-1.27; 16 6.35,1.27; 17 8.89,-1.27; 18 8.89,1.27; 19 11.43,-1.27; 20 11.43,1.27
1X01_ROUND = drill 1.245 pad 1.676: 1 0,0

### Placement (x,y rotation side)
15V_EN  15.62,19.94 0 top
APWR_EN  36.58,16.51 0 top
BAL_LEFT  95.25,10.41 270 bottom
BAL_RIGHT  67.31,10.41 270 bottom
C1  97.16,3.43 180 top
C2  95.89,19.05 0 top
C3  102.49,7.49 90 top
C4  102.62,13.46 90 top
C5  90.81,11.81 90 top
C6  90.81,8.26 90 top
C7  81.28,15.11 270 bottom
C8  81.15,5.71 90 bottom
C9  69.22,3.43 180 top
C10  69.34,18.29 270 top
C11  74.55,7.49 90 top
C12  74.55,13.21 90 top
C13  72.52,12.57 90 top
C14  72.52,7.49 90 top
C15  54.36,17.14 270 bottom
C16  47.37,15.75 90 bottom
C17  79.12,42.67 0 top
C18  74.42,32.89 270 top
C19  70.23,37.59 0 top
C20  87.63,32.77 0 top
C21  96.01,35.05 180 top
C22  87,35.81 90 top
C23  92.33,32.64 0 top
C24  84.2,27.94 0 top
C25  77.22,27.94 180 top
C26  3.3,31.11 90 top
C27  7.62,31.37 270 top
C28  11.56,17.14 270 top
C29  11.43,22.61 270 top
C30  8.51,16.38 270 top
C31  8.51,23.37 270 top
C32  19.56,16 270 top
C33  21.59,15.88 90 top
C34  33.02,18.41 270 top
C35  21.08,10.41 270 top
C36  19.56,22.23 90 top
C37  21.46,22.1 270 top
C38  17.91,31.88 0 top
C39  50.67,27.05 0 top
C40  46.23,16.38 180 top
C41  50.93,25.02 0 top
C42  46.23,18.41 180 top
C43  89.92,14.61 0 top
C44  88.77,7.87 90 top
C45  100.71,13.08 90 top
C46  100.46,8 90 top
C47  61.09,13.08 90 top
C48  59.82,7.49 0 top
C49  62.87,8.26 90 top
C50  62.87,11.81 90 top
C51  31.62,24.77 270 top
C52  84.45,44.7 270 top
C53  58.8,25.91 180 top
C54  66.04,30.48 90 top
C55  68.07,31.37 270 top
C56  111,35.69 270 top
C57  113.16,35.81 270 top
C58  112.78,39.88 270 top
C59  41.91,32.38 270 top
C60  39.88,32.26 270 top
C61  43.69,42.93 90 top
C62  64.52,44.07 90 top
C63  66.67,44.07 270 top
C64  64.39,40.13 270 top
C65  66.42,40.13 270 top
C66  45.59,43.18 90 top
C67  49.4,40.89 270 top
C68  47.5,40.13 270 top
C69  37.47,41.27 270 top
C70  35.56,41.53 270 top
C71  40.39,41.91 0 top
C72  36.7,38.48 0 top
C73  30.35,41.02 90 top
C74  28.83,36.7 270 top
C75  15.75,44.45 90 top
C76  26.92,47.24 270 top
C77  26.8,42.55 90 top
D1  28.83,19.3 0 top
D2  25.15,17.27 0 top
D3  24.13,31.11 270 top
D4  20.7,29.84 0 top
EN_3.3  67.82,27.81 0 top
EN_DAC_VCC  68.83,42.8 90 top
H1  2.54,2.54 0 top
H2  116.84,2.54 0 top
H3  2.54,48.26 0 top
H4  116.84,48.26 0 top
HP  36.58,47.12 0 top
HP_EN  28.83,46.1 90 top
IC1  80.64,36.7 180 top
IC2  106.68,10.29 180 top
IC3  94.36,10.29 180 top
IC4  79.5,10.41 180 top
IC5  48.01,21.72 270 top
IC6  66.42,10.29 180 top
IC7  59.05,40.89 90 top
IC8  60.83,29.72 90 top
IC9  5.33,32.64 270 bottom
IC10  LM317  [SOT223']  25.91,11.81 180 top
IC11  LM337  [SOT223']  26.8,26.42 0 top
IC12  114.94,38.61 270 bottom
IC13  42.42,37.59 270 top
IC14  21.34,46.35 90 top
J1  43.18,0 180 bottom
J5  7.62,10.16 180 bottom
JP1  81.15,21.72 0 top
L1  74.8,43.18 0 top
L2  72.14,34.42 90 top
L3  91.31,29.84 0 top
L4  90.3,34.92 0 top
L5  33.91,12.7 0 top
L6  33.91,22.35 270 top
L8  36.2,33.4 0 top
LED1  63.75,25.91 90 top
LED2  14.22,14.99 0 top
LED3  66.29,48.26 90 top
LED4  14.35,24.89 180 top
LED5  1.78,9.65 0 top
OSC1  89.53,43.43 0 top
R1  107.06,4.95 180 top
R2  106.81,15.62 180 top
R3  102.36,1.65 180 top
R4  98.17,7.49 90 top
R5  99.82,16.38 180 top
R6  98.17,13.08 270 top
R7  93.98,16.26 180 top
R8  92.08,4.45 180 top
R9  53.09,17.14 90 top
R10  50.55,17.14 90 top
R11  55.37,17.14 270 top
R12  53.09,21.46 90 top
R13  54.74,25.02 0 top
R14  89.66,2.16 180 top
R15  89.79,18.16 270 top
R16  85.09,4.95 90 top
R17  79.12,4.95 180 top
R18  78.87,15.62 180 top
R19  74.93,1.91 180 top
R20  70.23,7.49 90 top
R21  73.28,18.92 180 top
R22  69.98,13.08 270 top
R23  64.14,18.16 90 top
R24  64.14,4.45 180 top
R25  43.18,19.43 90 top
R26  46.23,25.4 180 top
R27  40.77,19.3 270 top
R28  43.05,23.62 90 top
R29  40.89,23.62 270 top
R30  55.24,9.65 180 top
R31  61.85,18.16 270 top
R32  64.14,2.16 180 top
R33  74.3,36.7 90 top
R34  73.91,40.77 0 top
R35  32.51,37.72 0 top
R36  32.51,35.69 0 top
R39  29.72,17.27 180 top
R40  31.24,14.86 180 top
R41  18.54,28.07 180 top
R42  22.1,26.67 270 top
R43  67.94,25.91 0 top
R44  16.38,14.99 90 top
R45  69.47,47.24 270 top
R46  16.51,24.89 270 top
R47  3.94,9.65 90 top
R48  88.14,38.86 180 top
R49  117.22,36.7 90 top
SV1  104.52,34.29 270 top
TP1  18.54,2.67 0 top
TP2  3.05,39.5 0 top
TP3  70.1,39.75 0 top
TP4  70.99,25.27 0 top
TP5  18.54,12.95 0 top
TP6  12.19,26.42 0 top
TP7  90.93,23.11 0 top
TP8  47.24,31.5 0 top
TP9  88.65,23.11 0 top
TP10  85.22,2.16 0 top
TP11  87.12,14.1 0 top
TP12  36.45,22.61 0 top
TP13  74.55,21.46 0 top
TP14  72.52,21.84 0 top
TP15  58.67,21.72 0 top
TP16  56.39,12.19 0 top
TP17  38.61,22.61 0 top
TP18  47.12,33.78 0 top
TP19  90.93,25.4 0 top
TP20  61.09,21.72 0 top
X1  115.57,13.59 270 top
X2  115.44,26.67 270 top

### Tracks (layer width: path | path; a pad name or v marks a point on that pad's centre or on a via)
3.3V  (via drill 0.33)
  Top 0.406: 68.96,27.69 EN_3.3.2 | 84.42,45.59 C52.1 | C52.1 86.97,45.55 OSC1.4 | R34.1 72.9,42.29 L1.1 73.79,43.94 75.95,46.1 83.91,46.1 C52.1 | 69.09,26.04 R43.2 69.6,25.27 TP4.1
  Top 0.61: 68.96,27.69 R43.2 | 72.77,36.7 v72.77,36.83 v72.77,37.72 v72.77,38.61 v72.77,39.5 72.77,40.64 R34.1
  Bottom 0.61: EN_3.3.2 69.09,33.02 72.77,36.7 v72.77,36.83 v72.77,37.72 v72.77,38.61
+12V
  Top 0.406: IC8.7 59.05,29.08 59.31,29.34 59.31,31.11 58.8,31.62 IC8.5
  Top 0.61: IC14.5 18.26,49.76 18.29,49.78
  Top 0.889: IC8.8 57.76,26
  Top 1.016: IC8.7 IC8.8
  Top 1.143: J5.+ 11.81,10.16 10.16,11.81 6.1,11.81 5.46,12.45 3.81,12.45 | 3.81,12.45 2.54,12.45 1.65,13.34 1.65,33.66 | 1.65,33.66 1.65,39.62 | 1.65,39.62 1.65,41.4 3.3,43.05 5.33,43.05 7.49,45.21 7.49,48.01 9.27,49.78 15.75,49.78 18.29,49.78 32.64,49.78 | R47.2 3.94,12.32 3.81,12.45 | 58.8,31.62 53.98,31.62 51.56,34.04 51.56,49.66 51.44,49.78 | IC7.3 64.5,43.2 C62.1 66.58,43.22 C63.2 | IC9.1 4.43,32.64 C26.+ 1.76,33.77 1.65,33.66 | 32.64,49.78 51.44,49.78 | 51.44,49.78 62.48,49.78 | 62.48,49.78 107.82,49.78 112.9,44.7 112.9,40.77 | IC12.P$2 113.36,40.31 112.9,40.77 | 112.9,40.77 C58.1 | 62.36,43.23 62.36,49.66 62.48,49.78 | HP.P$1 32.77,49.66 32.64,49.78 | 57.76,26 57.76,25.93 C53.2 | 15.81,45.34 15.81,45.41 C75.2 | TP2.1 1.78,39.5 1.65,39.62
  Top 1.27: 18.29,45.09 18.12,44.92 18.26,44.78 IC14.8 IC14.7 17.89,45.34 15.81,45.34 | IC9.1 7.2,32.64 C27.1 | C75.2 15.75,49.78
  pour Top (no thermals): 61.47,42.55 61.47,42.42 67.18,42.42 67.18,43.81 63.5,43.81 63.5,46.99 61.21,46.99 61.21,42.42 61.34,42.42
+15V
  Top 0.406: TP5.1 18.54,14.86 18.41,14.99
  Top 1.143: 15V_EN.2 16.89,16.38 | 16.89,16.38 18.29,14.99 18.41,14.99 C32.2 19.6,15.03 C33.1 21.7,14.91 IC10.3 23.6,16.97 D2.C | R44.2 16.51,16 16.89,16.38
-15V
  Top 0.406: 16.98,21.21 15V_EN.4 14.35,23.75 LED4.C 13.75,23.84 12.95,24.64 12.95,25.65 TP6.1
  Top 1.143: IC11.2 26.8,21.97 26.04,21.21 21.5,21.21 C37.2 19.6,21.25 C36.1 15V_EN.4 | 26.8,24 IC11.2 | IC11.2 IC11.4 24.38,29.52 D3.A
AVCC  (via drill 0.33)
  Top 0.406: IC5.8 50.42,23.62 | C5.1 90.72,11.05 90.17,11.05 | 93.6,13.23 IC3.3 | 93.6,11.21 93.34,10.96 | 72.68,11.72 C13.1
  Top 0.508: 74.59,12.32 75.56,12.32 75.95,11.94 78.23,11.94 78.87,12.57 IC4.3
  Top 0.61: C5.1 93.34,10.96 94.19,10.96 94.61,10.54 99.44,10.54 100.71,11.81 C45.1 100.84,11.94 101.22,11.94 101.89,12.61 C4.1 103.04,12.19 103.89,12.19 104.39,11.68 105.92,11.68 106.05,11.81 IC2.3 | 93.6,11.21 93.6,13.23 | C13.1 71.63,11.56 70.99,10.92 65.91,10.92 | 65.91,10.92 62.9,10.92 | 88.9,11.43 v88.9,13.34 C43.1 89.79,13.72 89.79,11.43 90.17,11.05 | v49.02,16.89 48.26,17.65 48.26,22.48 48.77,22.99 48.77,26.16 C39.1 50.08,26.63 C41.1 50.08,23.66 50.04,23.62 IC5.8 | v58.04,13.46 v58.67,12.83 v59.31,12.19 59.44,12.06 C47.1 62.23,10.92 62.9,10.92 | 62.9,10.92 C50.1 | IC6.3 65.79,11.05 65.91,10.92 | 72.68,11.72 73.91,11.72 C12.1 74.59,12.32
  Bottom 0.406: v88.9,11.56 88.9,11.3
  Bottom 0.61: v88.9,13.34 v88.9,12.45 v88.9,11.56 88.77,11.43 88.39,11.43 87.36,12.46 C7.+ | v49.02,16.89 49.02,16.26 48.51,15.75 | 59.44,12.06 v59.31,12.19 v58.67,12.83 v58.04,13.46 58.04,14.35
  Bottom 0.813: APWR_EN.2 45.47,15.24 45.97,15.75 48.51,15.75 53.98,15.75
  Bottom 0.889: C7.+ 80.38,12.46 79.63,13.21 64.39,13.21 63.25,14.35 58.04,14.35 54.5,14.35 C15.+ 54.36,15.37 53.98,15.75
AVDD  (via drill 0.33)
  Top 0.406: IC5.4 45.38,19.78 C42.2 45.38,16.55 C40.2 45.21,14.48 v44.83,14.1 | 90.72,9.02 C6.2 | 93.6,7.34 IC3.6 | 93.6,8.85 93.34,9.11 | C46.2 100.46,9.27
  Top 0.508: C11.2 76.16,8.34 76.96,9.14 78.23,9.14 78.87,8.51 IC4.6
  Top 0.61: 93.6,7.34 93.6,8.85 | 65.79,10.03 71.5,10.03 72.52,9.02 C14.2 74.38,8.51 C11.2 | 65.79,10.03 63.79,10.03 C49.2 61.43,9.11 61.09,8.76 60.96,8.76 | IC6.6 65.79,10.03 | 60.83,8.76 v60.45,8.76 | v58.55,8.76 v60.45,8.76 | v85.72,8 v86.61,8 v87.5,8 88.39,8.89 C44.2 90.59,8.89 C6.2 93.34,9.11 94.19,9.11 94.74,9.65 99.82,9.65 C46.2 101.81,9.02 C3.2 102.53,8.38 103.12,8.38 103.5,8.76 105.28,8.76 106.05,8 IC2.6 | 60.96,8.76 v60.45,8.76 | C48.2 60.83,8.64 60.96,8.76
  Bottom 0.406: 51.19,9.53 51.19,9.51 51.31,9.4 51.32,9.4 51.7,9.02 | 81.79,2.54 81.17,2.54 81.17,3.05 C8.- | v44.83,14.1 43.81,13.08 | 80.77,1.52 80.77,2.02 81.17,2.41 | 52.07,8.76 52.07,8.65 52.52,8.2
  Bottom 0.61: 52.07,8.76 v58.55,8.76 v59.44,8.76 v60.45,8.76 | v87.5,8 84.45,8 83.57,7.11 83.57,4.32 81.79,2.54
  Bottom 0.813: 37.47,17.78 36.58,16.89 36.58,13.97 37.47,13.08 43.81,13.08 47.61,13.08
  Bottom 0.889: 81.17,2.54 81.17,2.41 81.17,1.92 | APWR_EN.4 37.47,17.78 | 47.61,13.08 47.6,13.09 C16.- 47.62,13.09 51.7,9.02 52.52,8.2 52.96,7.76 52.96,2.16 53.59,1.52 80.77,1.52
CAN_H
  Top 0.406: X2.P$3 114.55,25.4 113.79,24.64 113.79,14.22 115.57,12.45 X1.P$3
CAN_L
  Top 0.406: X2.P$2 115.7,27.94 116.71,26.92 116.71,20.83 114.43,18.54 114.43,16 X1.P$2
DAC_VCC
  Top 0.406: L4.2 94.49,34.92 94.55,34.99 94.61,35.05 C21.2 | R45.2 69.47,44.07
  Top 0.559: 71.37,39.88 70.99,39.88 70.87,39.75
  Top 0.889: 94.61,35.05 94.61,46.86 94.11,47.37 73.28,47.37 71.37,45.47 71.37,44.07 | 94.55,34.99 94.62,34.92 94.62,33.98 C23.2 93.28,30.8 L3.2 | EN_DAC_VCC.2 69.47,44.07 71.37,44.07 | 71.37,36.2 L2.2 | 71.37,44.07 71.37,39.88
  Top 1.143: 71.37,36.2 71.37,37.4 C19.2 71.25,37.66 71.25,39.75 70.87,39.75 TP3.1
GND  (via drill 0.33, 0.6)
  Top 0.406: C40.1 47.08,16.55 C42.1 47.08,20.79 v47.24,20.95 | IC3.2 95,11.68 v95.12,11.56 | IC3.7 95,8.64 v95.12,8.76 | 100.62,7.15 C46.1 | C1.2 v96.65,3.43 | v68.07,3.43 C9.2 66.63,3.05 66.04,3.05 R32.1 | IC6.7 v67.06,9.02 | IC6.2 v67.06,11.81 | C11.1 74.55,6.99 | 1.74,10.67 LED5.C 0.64,9.56 0.64,7.49 1.14,6.99 5.08,6.99 v5.59,7.49 | LED1.C 61.98,25.91 v61.47,26.42 | LED2.C 11.85,16.04 C28.2 | R46.2 16.64,23.88 v17.78,25.02 | IC1.16 77.07,31.86 76.83,31.62 74.84,31.62 C18.2 73.83,32.04 72.77,30.99 v72.39,30.99 | IC1.19 79.02,31.34 v79.38,30.99 | C49.1 v62.87,6.22 | C48.1 v57.66,7.49 | v90.93,15.88 C43.2 90.81,14.48 C5.2 | R11.2 56.01,16.13 v56.64,16.76 | R33.2 75.69,37.72 v75.95,37.97 | C52.2 84.49,43.81 84.49,42.84 v84.45,42.8 | 83.57,38.98 IC1.3 83.57,41.53 v83.82,41.78 | v82.55,30.1 82.27,30.38 IC1.24 | IC1.27 84.22,34.05 84.45,34.29 85.47,34.29 85.98,33.78 87.88,33.78 88.48,33.19 C20.2 89.15,32.77 90.04,31.88 v90.04,31.11 | C22.2 87.03,36.7 89.79,36.7 90.55,37.47 v90.55,39.24 | IC13.11 44.2,34.67 v43.81,35.05 | IC13.16 43.74,37.92 v43.69,37.97 | IC13.19 43.19,39.87 42.42,40.64 42.42,42.51 C61.2 43.69,44.07 | IC13.3 38.76,39.22 37.97,40.01 37.5,40.01 37.5,40.39 C69.2 | 34.67,39.12 v34.54,39.24 35.31,38.48 C72.1 | IC13.9 38.72,35.32 v38.35,35.69 | IC13.10 37.85,34.67 v37.59,34.92 | C73.2 30.61,42.04 31.37,41.27 31.37,40.39 v31.75,40.01 | IC1.8 80.32,42.32 C17.2 79.97,43.6 v79.63,43.94 | OSC1.2 92.08,43.05 v92.33,43.31 | C74.1 v28.83,38.99 | LED3.C 65.24,46.52 v65.41,46.35 | C59.2 40.1,31.54 C60.2 38.41,31.31 v38.35,31.37 | R27.2 v40.77,16.89 | v19.43,9.02 19.55,9.02 19.55,9.01 | 85.6,3.94 R16.1 84.45,3.94 v83.31,2.79
  Top 0.406: 62.74,12.79 62.74,15.11 v62.48,15.37 | C47.2 v61.09,15.37 | C2.1 v95,19.05 | C4.2 102.96,14.31 v103.63,14.99 | C45.2 100.33,14.1 v99.57,14.86 | C10.1 v69.34,19.3
  Top 0.508: C3.1 102.49,6.6 102.74,6.6 v103.5,5.84 | C46.1 100.46,5.84 v100.08,5.46 | IC4.7 80.14,8.89 v79.76,9.27 | IC4.2 80.14,11.43 v79.63,10.92
  Top 0.61: v52.96,27.05 C39.2 51.69,25.11 C41.2 | IC14.4 v22.73,48.26 v21.84,48.26 v20.95,48.26 v20.07,48.26 | 43.69,44.07 45.53,44.07 C66.2 v45.59,45.59 | C68.1 48.36,41.84 C67.1 v49.4,43.43 | 62.74,12.79 C50.2 | C14.1 v72.52,5.33 | C11.1 74.55,5.84 v74.3,5.59 | C13.2 v72.52,14.99 | C12.2 v74.55,15.37 | C6.1 v90.81,6.22 | C44.1 v88.77,5.59 | IC2.2 v107.31,11.68 | IC2.7 v107.31,8.76
  Top 0.889: C19.1 69.28,36.39 v69.22,36.32 | C23.1 91.38,31.18 v91.31,31.11 | C21.1 96.96,37.4 v97.03,37.47 | C36.2 v19.56,24.89
  Top 1.143: R41.2 v16,28.07 | C51.1 v31.62,27.94 | R40.1 33.02,14.86 | 33.02,14.86 v33.53,14.86 | C35.2 19.55,9.01 | IC9.2 4.94,30.1 C26.- | C27.2 v7.62,29.34 v7.62,28.32 v7.62,27.43 | R49.2 116.33,38.61 IC12.P$3 113.03,38.61 C58.2 | C32.1 v19.56,18.16 | C33.2 v21.59,18.41 | C34.2 33.02,14.86 | C38.1 16.96,30.29 v17.02,30.23 | C69.2 35.71,40.42 C70.2 34.35,40.58 v33.78,41.15 | C77.1 22.41,41.59 v22.35,41.66 | v22.61,22.99 21.5,22.99 C37.1 | 16.58,42.67 16.51,42.67 C75.1
  Top 1.27: 5.75,30.52 IC9.2 | C29.1 10.07,24.01 C31.1+ 3.6,25.57 v3.56,25.53 | v3.56,14.22 3.6,14.18 C30.2- 10.07,15.74 C28.2 | v19.94,42.67 v19.05,42.67 v18.16,42.67 v17.27,42.67 16.58,42.67
  Bottom 0.406: v95.12,11.56 95.38,11.3 | v96.65,3.43 96.9,3.43 | v68.07,3.43 68.33,3.43 | v67.06,9.02 67.06,9.14 | v79.38,30.99 79.38,30.61 | v72.39,30.99 72.14,30.99 | v62.87,6.22 62.87,5.84 | v56.64,16.76 56.77,16.89 | v47.24,20.95 47.37,21.08 | v75.95,37.97 76.07,37.97 76.2,38.1 | v43.81,35.05 43.81,35.43 | v43.69,37.97 43.56,38.1 | v38.35,35.69 38.23,35.69 38.1,35.81 | v37.59,34.92 37.34,35.18 | v31.75,40.01 31.88,39.88 | v79.63,43.94 79.12,43.94 | v92.33,43.31 92.58,43.56 | v83.82,41.78 83.95,41.91 | v40.77,16.89 40.77,16.64 | v5.59,7.49 5.59,7.87 | v62.48,15.37 62.36,15.49 | v61.09,15.37 61.09,15.49 | v95,19.05 95.25,19.05 | v103.63,14.99 103.89,14.99 | v99.57,14.86 99.44,14.99
  Bottom 0.508: v100.08,5.46 99.95,5.33 | v79.76,9.27 79.63,9.4 | v79.63,10.92 79.5,10.92
  Bottom 0.61: v52.96,27.05 53.09,27.05 | v72.52,5.33 72.52,5.08 | v74.3,5.59 74.17,5.46 | v72.52,14.99 72.52,15.24 | v90.81,6.22 90.81,5.97 | v88.77,5.59 88.77,5.33 | v107.31,11.68 107.31,11.43 | v107.31,8.76 107.31,8.89
  Bottom 1.143: v16,28.07 15.75,28.07 | v31.62,27.94 31.62,28.19 31.75,28.32
  other vias: 64.52,46.35 66.29,46.35 62.1,37.21 62.1,36.32 62.1,35.43 63.25,35.43 63.25,36.32 63.25,37.21 64.26,37.21 64.26,36.32 64.26,35.43 65.28,35.43 65.28,36.32 65.28,37.21 61.47,27.3 61.47,28.19 61.47,29.08 61.47,29.97 61.47,30.86 61.47,31.75 61.47,32.77 62.36,32.77 63.25,32.77 64.14,32.77 60.58,28.19 60.58,29.08 60.58,29.97 60.58,30.86 60.58,31.75 6.22,25.53 5.33,25.53 4.45,25.53 4.45,14.22 5.33,14.22 6.22,14.22 113.41,32.77 113.41,33.66 112.52,33.66 112.52,32.77 23.24,41.66 24.13,41.66 25.02,41.66
  pour Bottom: -1.27,53.34 123.19,53.34 123.19,0.64 -1.27,0.64
  pour Top (no thermals): 64.01,44.45 64.01,46.99 67.82,46.99 67.82,44.45
  pour Top (no thermals): 61.34,34.8 61.34,39.75 67.18,39.75 67.18,34.8
  pour Top (no thermals): 59.82,25.78 59.82,33.66 68.83,33.66 68.83,32.51 64.9,32.51 64.9,31.37 62.1,31.37 62.1,25.78
  pour Top: 113.92,37.21 110.11,37.21 110.11,32.13 113.92,32.13 113.92,37.08
HP_L_OUT  (via drill 0.33)
  Top 0.406: R35.1 31.5,38.23 | 31.5,38.23 31.5,38.86 C73.1 | v33.15,39.24 32.51,39.24 31.5,38.23
  Bottom 0.406: v33.15,39.24 33.15,39.37 40.39,46.61 HP.P$4
HP_R_OUT  (via drill 0.33)
  Top 0.406: C74.2 29.97,35.69 | 29.97,35.69 R36.1 | v29.97,36.7 29.97,35.69
  Bottom 0.406: v29.97,36.7 29.97,39.24 HP.P$3
HP_VCC  (via drill 0.33)
  Top 0.406: IC13.1 38.86,40.52 38.35,41.02 38.35,41.24 C69.1 | v43.81,40.77 43.81,41.95 C61.1 | IC13.17 44.36,38.57 v43.81,39.12 | IC13.20 45.34,41.8 45.25,41.88
  Top 0.61: C69.1 37.63,42.29 37.72,42.29 43.31,47.88 46.74,47.88 47.37,47.24 47.37,43.18 46.35,42.16 45.66,42.16 C66.1 | L8.1 28.45,33.4 27.3,34.54 27.3,39.12 28.83,40.64 28.83,42.55 31.69,45.4 | C66.1 43.84,42.23 C61.1 | 45.25,41.88 C66.1
  Top 1.143: HP_EN.2 29.72,47.37 31.69,45.4 34.67,42.42 35.5,42.42 C70.1 37.11,42.48 C69.1
  Bottom 0.406: v43.81,40.77 v43.81,39.12
I2S_BCK  (via drill 0.33)
  Top 0.406: v82.68,36.45 81.62,37.51 IC1.6 81.62,44.49 v81.03,45.09 | IC13.13 47.65,35.97 v49.15,37.47
  Bottom 0.406: 49.15,37.59 v49.15,37.47 59.69,48.01 78.11,48.01 v81.03,45.09 | v82.68,36.45 82.68,36.32 83.31,35.69 100.84,35.69 SV1.7
I2S_DATA  (via drill 0.33)
  Top 0.406: IC1.5 82.27,37.87 v83.57,36.58
  Bottom 0.406: v83.57,36.58 99.19,36.58 SV1.5
I2S_DATA2  (via drill 0.33)
  Top 0.406: IC13.14 47.28,36.62 v49.28,38.61
  Bottom 0.406: SV1.1 101.85,44.32 101.85,42.8 101.09,42.04 98.93,42.04 95.12,38.23 83.57,38.23 82.04,39.75 82.04,45.21 78.61,48.64 59.31,48.64 v49.28,38.61
I2S_LRCK  (via drill 0.33)
  Top 0.406: v83.69,37.47 82.92,38.24 IC1.4 82.92,44.59 v82.8,44.7 | IC13.15 46.54,37.27 v46.74,37.47
  Bottom 0.406: v82.8,44.7 82.8,45.59 78.99,49.4 58.67,49.4 v46.74,37.47 | v83.69,37.47 95.38,37.47 99.19,41.27 101.35,41.27 SV1.3
I2S_MCK  (via drill 0.33)
  Top 0.406: R48.2 86.23,38.86 85.34,37.97 85.34,36.58 84.45,35.69 82.3,35.69 v81.41,36.58 80.97,37.01 IC1.7 80.97,44.12 v80.14,44.96 | IC13.12 47.37,35.32 | 47.37,35.32 48.27,35.32 v50.16,37.21 | TP18.1 47.12,35.06 47.37,35.32
  Bottom 0.406: v81.41,36.58 83.06,34.92 102.62,34.92 SV1.9 | v80.14,44.96 77.85,47.24 60.2,47.24 v50.16,37.21
IN_L_NN
  Top 0.406: 107.95,15.75 R2.1 | R2.1 101.6,21.84 96.14,21.84 95.25,20.95 85.47,20.95 JP1.7 | IC2.1 108.58,14.86 R2.1
  Bottom 0.406: TP9.1 88.65,18.92 88.14,18.41 87,18.41 JP1.7
IN_L_PP
  Top 0.406: JP1.5 83.69,21.72 90.93,21.72 | TP7.1 90.93,21.72 | 90.93,21.72 95.12,21.72 95.89,22.48 101.85,22.48 107.44,16.89 108.46,16.89 109.35,16 109.35,8.64 108.58,7.87 IC2.8 108.58,5.46 R1.1
IN_R_NN
  Top 0.406: 80.14,15.88 R18.1 | R18.1 79.88,19.3 | 79.88,19.3 JP1.3 | 79.88,19.3 79.76,19.18 76.58,19.18 75.69,20.07 73.15,20.07 72.52,20.7 TP14.1 | IC4.1 81.41,14.73 80.52,15.62 R18.1
IN_R_PP
  Top 0.406: R17.1 81.41,6.22 IC4.8 81.41,8.38 82.3,9.27 82.3,16.26 81.03,17.53 81.03,21.21 80.52,21.72 78.61,21.72 JP1.1 76.33,20.45 75.31,21.46 TP13.1
N$1
  Top 0.406: R3.1 103.63,1.65 106.05,4.06 R1.2 104.78,6.22 IC2.5
N$2
  Top 0.406: R5.1 100.84,16.89 102.36,18.41 104.01,18.41 105.79,16.64 R2.2 105.79,15.24 104.78,14.22 IC2.4
N$3
  Top 0.406: R4.1 98.17,4.61 C1.1 101.13,1.65 R3.2
N$4
  Top 0.406: C2.2 98.08,16.26 | 98.08,16.26 98.08,14.18 R6.1 | R5.2 98.21,16.38 98.08,16.26
N$5
  Top 0.406: R8.1 94.11,5.46 95.89,5.46 96.14,5.71 96.14,7.09 IC3.8 96.39,7.34 96.39,8 96.9,8.51 R4.2
N$6
  Top 0.406: R6.2 97.92,12.06 97.66,12.32 96.65,12.32 96.39,12.57 96.39,13.23 IC3.1 96.27,14.99 R7.1
N$7
  Top 0.406: IC1.17 77.72,31.24 77.22,30.73 73.53,30.73 72.14,29.34 72.14,26.67 75.82,22.99 JP1.2
N$8
  Top 0.406: IC1.18 78.37,31 77.47,30.1 73.79,30.1 72.77,29.08 72.77,26.92 75.18,24.51 78.36,24.51 JP1.4
N$9
  Top 0.406: IC5.5 51.44,19.81 R9.2 R11.1
N$10
  Top 0.406: R12.1 52.45,21.08 IC5.6 49.15,21.08 49.02,20.95 49.02,19.18 50.04,18.16 R10.2
N$11
  Top 0.406: IC5.7 52.96,22.35 | 52.96,22.35 R12.2 | 52.96,22.35 52.96,24.26 R13.1
N$12
  Top 0.406: R13.2 55.75,26.42 53.85,28.32 42.16,28.32 TP12.1 36.45,21.08 38.99,18.54 38.99,14.48 34.92,10.41 32.34,10.41 J1.L_SIG
N$13
  Top 0.406: BAL_LEFT.S 85.23,5.97 R16.2
N$14
  Top 0.406: BAL_LEFT.T 86.11,15.73 86.09,15.73 84.45,14.1 84.45,7.75 85.09,7.11 85.72,7.11 87.25,5.59 87.76,5.59 88.65,4.7 R14.2 TP10.1
N$15
  Top 0.406: BAL_LEFT.R 87.14,14.35 | 87.14,14.35 87.14,14.62 88.14,15.62 88.27,15.62 R15.2 | TP11.1 87.12,14.34 87.14,14.35
N$16
  Top 0.406: R19.1 76.96,1.91 78.11,3.05 R17.2 77.6,5.46 IC4.5
N$17
  Top 0.406: R21.1 75.95,18.92 77.85,17.02 R18.2 77.6,15.37 IC4.4
N$18
  Top 0.406: R20.1 70.23,4.61 C9.1 72.94,1.91 R19.2
N$19
  Top 0.406: R22.1 69.98,16.13 69.85,16.13 | 69.85,16.13 69.38,16.13 C10.2 | 69.85,16.13 69.85,16.51 R21.2
N$20
  Top 0.406: R24.1 65.53,4.45 66.55,5.46 67.69,5.46 68.33,6.1 IC6.8 68.33,7.87 68.96,8.51 R20.2
N$21
  Top 0.406: R22.2 68.68,13.36 IC6.1 68.33,14.61 67.82,15.11 66.17,15.11 R23.1
N$22
  Top 0.406: IC1.26 83.57,31.87 84.45,30.99 87.88,30.99 89.15,29.72 89.15,25.91 86.23,22.99 JP1.8
N$23
  Top 0.406: IC1.25 82.92,31.38 83.95,30.35 87.5,30.35 88.39,29.46 88.39,26.16 86.36,24.13 84.2,24.13 83.06,22.99 JP1.6
N$24
  Top 0.406: IC5.3 43.81,21.08 R25.2 40.89,20.45 R27.1
N$25
  Top 0.406: R28.1 43.31,22.35 IC5.2 46.48,22.35 46.99,22.86 46.99,24.26 46.86,24.38 45.59,24.38 45.21,24.77 R26.2
N$27  (via drill 0.6)
  Top 0.406: R29.2 39.5,22.61 | 39.5,22.61 TP17.1 | v39.5,11.56 39.75,11.81 39.75,22.35 39.5,22.61
  Bottom 0.406: J1.R_SIG 40.8,10.25 v39.5,11.56
N$28
  Top 0.406: R32.2 61.1,2.16 BAL_RIGHT.S
N$29
  Top 0.406: R30.2 54.23,11.94 59.05,16.76 BAL_RIGHT.T
  Bottom 0.406: BAL_RIGHT.T 59.2,21.2 TP15.1
N$30
  Top 0.406: R31.2 61.72,17.14 59.69,15.11 58.55,15.11 56.39,12.95 TP16.1 58.17,10.41 BAL_RIGHT.R
N$31
  Top 1.143: X1.P$1 117.86,19.68 117.86,29.59 116.97,30.48 X2.P$1 110.24,30.48 108.84,31.88 108.84,35.94 109.53,36.64 C56.1 113.13,36.64 C57.1 113.2,36.7 113.92,36.7 114.12,36.91 IC12.P$4
N$32
  Top 0.406: R48.1 89.15,42.61 OSC1.3
N$33
  Top 1.143: IC12.P$5 116.74,35.2 R49.1
N$34
  Top 0.406: IC5.1 44.07,23.62 R28.2 R29.1
N$35
  Top 0.406: IC1.20 79.67,34.25 78.23,35.69 R33.1
N$36
  Top 0.406: IC1.15 75.09,33.08 C18.1
  Top 0.889: C18.1 72.48,33.74 L2.1
N$37
  Top 0.406: IC1.9 79.67,41.27 C17.1 76.33,42.67 L1.2
N$38
  Top 0.406: IC1.28 85.18,32.77 C20.1 87.8,31.75 88.27,31.75 90.17,29.84 L3.1
N$39
  Top 0.406: C25.+ 75.17,27.45 76.2,26.42 84.73,26.42 C24.+ 84.85,29.34 82.17,29.34 81.62,29.89 IC1.23 81.62,34.38 82.3,35.05 86.91,35.05 C22.1 89.24,34.96 L4.1
N$40
  Top 0.406: IC1.22 80.97,29.12 C24.-
N$41
  Top 0.406: IC1.21 80.32,28.99 C25.-
N$42
  Top 0.406: IC1.14 75.37,40.33 R34.2
N$43
  Top 0.406: IC13.8 41.12,35.97 41.91,35.18 C59.1 39.91,33.23 C60.1 37.4,33.21 L8.2 37.46,33.15
N$44
  Top 0.406: IC13.18 47.31,39.22
  Top 0.61: C67.2 48.74,39.28 C68.2 47.43,39.22 47.31,39.22
N$45
  Top 0.406: IC13.2 40.12,39.87 40.51,40.26 40.51,40.77 C71.1
N$46
  Top 0.61: C55.2 67.5,30.42 66.67,31.24 66.13,31.24 C54.2
  Top 1.016: IC8.2 IC8.1 EN_3.3.1
  Top 1.143: C55.2 68.07,29.34 EN_3.3.1
N$47
  Top 0.406: IC8.3 65.32,30.35 C54.1
N$49
  Top 1.143: C31.2- 11.39,21.17 C29.2 15V_EN.3
  Top 1.27: IC9.5 7.2,22.48 C31.2-
N$50
  Top 1.143: C28.1 14.23,18.55 15V_EN.1
  Top 1.27: IC9.7 7.33,17.4 C30.1+ 11.52,18.58 C28.1
N$51
  pour Top (no thermals): 66.93,40.26 66.93,41.66 60.45,41.66 60.45,45.97 52.58,45.97 52.58,34.8 60.45,34.8 60.45,40.26
  pour Top (no thermals): 66.93,41.78 67.18,41.78 67.56,42.16 69.6,42.16 69.6,40.26 66.93,40.26
N$52
  Top 1.143: APWR_EN.1 35.31,13.08 L5.2
N$53
  Top 0.889: IC10.2 25.91,15.93
  Top 1.143: IC10.2 25.91,12.45 | 25.91,12.45 25.91,11.81 | 25.91,11.81 IC10.4 | L5.1 26.16,12.7 25.91,12.45 | 25.91,15.93 25.91,16.18 D2.A | D1.C 26.98,17.29 D2.A | R39.2 D2.A | C35.1 25.91,11.81
N$54
  Top 0.889: 30.23,15.49 30.23,15.37 R40.2
  Top 1.143: IC10.1 30.18,14.91 R40.2 30.1,14.99 | 30.23,15.37 30.73,15.88 R39.1 30.68,17.33 D1.A 32.96,19.3 C34.1
N$55
  Top 0.889: APWR_EN.3 35.31,19.94 L6.2
N$56
  Top 0.406: LED1.A R43.1
N$57
  Top 1.143: L6.1 C51.2 31.57,23.32 IC11.3 29.11,26.95 29.84,27.69 29.84,31.24 29.21,31.88 25.22,31.88 D3.C 24.06,32.89 23.37,32.89 22.55,32.08 D4.A 22.1,29.39 R42.1
N$58
  Top 1.143: IC11.1 24.49,24.79 23.62,25.65 R42.2 21.59,25.65 19.94,27.3 19.94,27.69 R41.1 19.56,29.14 D4.C C38.2
N$59
  Top 0.406: R45.1 LED3.A
N$60
  Top 0.406: R44.1 14.26,13.97 LED2.A
N$61
  Top 0.406: LED4.A 16.48,25.94 R46.1
N$62
  Top 0.406: LED5.A 3.9,8.6 R47.1
N$64
  Top 0.406: C71.2 41.4,39.24 40.73,38.57 IC13.4
N$65
  Top 0.406: IC13.5 37.9,37.92 37.9,38.3 C72.2
N$66
  Top 0.61: C76.1 26.63,48.09 25.53,46.99 IC14.3
N$67
  Top 0.406: IC13.6 33.98,37.27 R35.2
N$68
  Top 0.406: IC13.7 34.46,36.62 R36.2
N$71
  pour Top (no thermals): 22.35,43.69 22.35,43.31 22.35,42.67 28.83,42.67 28.83,43.43 30.1,43.43 30.1,45.72 30.1,46.35 22.35,46.35 22.35,45.97
OUT_L_NN  (via drill 0.33)
  Top 0.406: R10.1 50.55,16.38 49.4,17.53 49.4,17.78 v49.15,18.03 | R15.1 v87.5,19.18 | v56.77,22.73 57.53,22.73 58.04,23.24 74.68,23.24 v76.07,21.84 | IC3.4 92.46,16.26 | 92.46,16.26 R7.2 | R15.1 89.79,18.92 | 92.46,16.26 92.46,18.41 91.69,19.18 R15.1
  Bottom 0.406: v56.77,22.73 50.04,22.73 48.9,21.59 48.9,18.29 v49.15,18.03 | v87.5,19.18 87.5,19.3 86.61,20.19 86.61,21.08 85.85,21.84 v76.07,21.84
OUT_L_PP  (via drill 0.33)
  Top 0.406: R9.1 53.09,15.37 52.45,15.37 47.75,10.67 v47.75,9.27 | IC3.5 92.46,6.35 91.06,4.95 R8.2 | R8.2 91.06,2.54 R14.1 | R8.2 91.06,1.02 90.81,0.76 50.29,0.76 v49.66,1.4
  Bottom 0.406: v47.75,9.27 47.75,2.92 49.28,1.4 v49.66,1.4
OUT_R_NN  (via drill 0.33)
  Top 0.406: v47.75,23.75 47.75,24.89 R26.1 | v54.1,23.5 58.42,19.18 R31.1 63.12,19.18 | 63.12,19.18 R23.2 | IC6.4 64.52,14.61 62.99,16.13 62.99,19.05 63.12,19.18
  Bottom 0.406: v54.1,23.5 48.01,23.5 v47.75,23.75
OUT_R_PP
  Top 0.406: 62.74,4.06 R24.2 63.12,4.95 | IC6.5 64.52,6.35 63.12,4.95 | R25.1 43.18,10.92 45.85,8.26 53.34,8.26 | R30.1 56.26,8.26 53.34,8.26 | 63.12,4.95 60.83,4.95 60.07,5.71 58.17,5.71 57.66,5.21 57.66,2.67 57.15,2.16 53.85,2.16 53.21,2.79 53.21,8.13 53.34,8.26
SPI_CLK  (via drill 0.33)
  Top 0.406: IC1.12 77.72,37.85 v78.49,37.08
  Bottom 0.406: v78.49,37.08 78.49,36.2 82.17,32.51 100.71,32.51 101.85,31.37 101.85,30.1 102.62,29.34 104.01,29.34 104.52,28.83 104.52,26.67 SV1.17
SPI_CS  (via drill 0.33)
  Top 0.406: IC1.10 79.02,38.84 v79.88,37.97
  Bottom 0.406: v79.88,37.97 80.14,37.72 80.14,36.58 82.68,34.04 102.49,34.04 103.25,33.27 SV1.11
SPI_MISO  (via drill 0.33)
  Top 0.406: IC1.13 77.07,37.48 v77.47,37.08
  Bottom 0.406: v77.47,37.08 77.47,36.2 81.79,31.88 100.33,31.88 101.09,31.11 101.09,29.72 102.87,27.94 SV1.15
SPI_MOSI  (via drill 0.33)
  Top 0.406: IC1.11 78.37,38.22 v79.38,37.21
  Bottom 0.406: v79.38,37.21 79.38,36.32 82.55,33.15 101.09,33.15 103.25,30.99 SV1.13

### Text on the board
tPlace: narvi-dac rev 1.0 | Eran Rundstein, 2017 | Pulsar Heavy Industries | +12V | GND | R | L | 5V | GND | 5V | GND